# EAGLE design Master Controller Circuit (EAGLE 7.2.0)

## Sheet 1 of 5
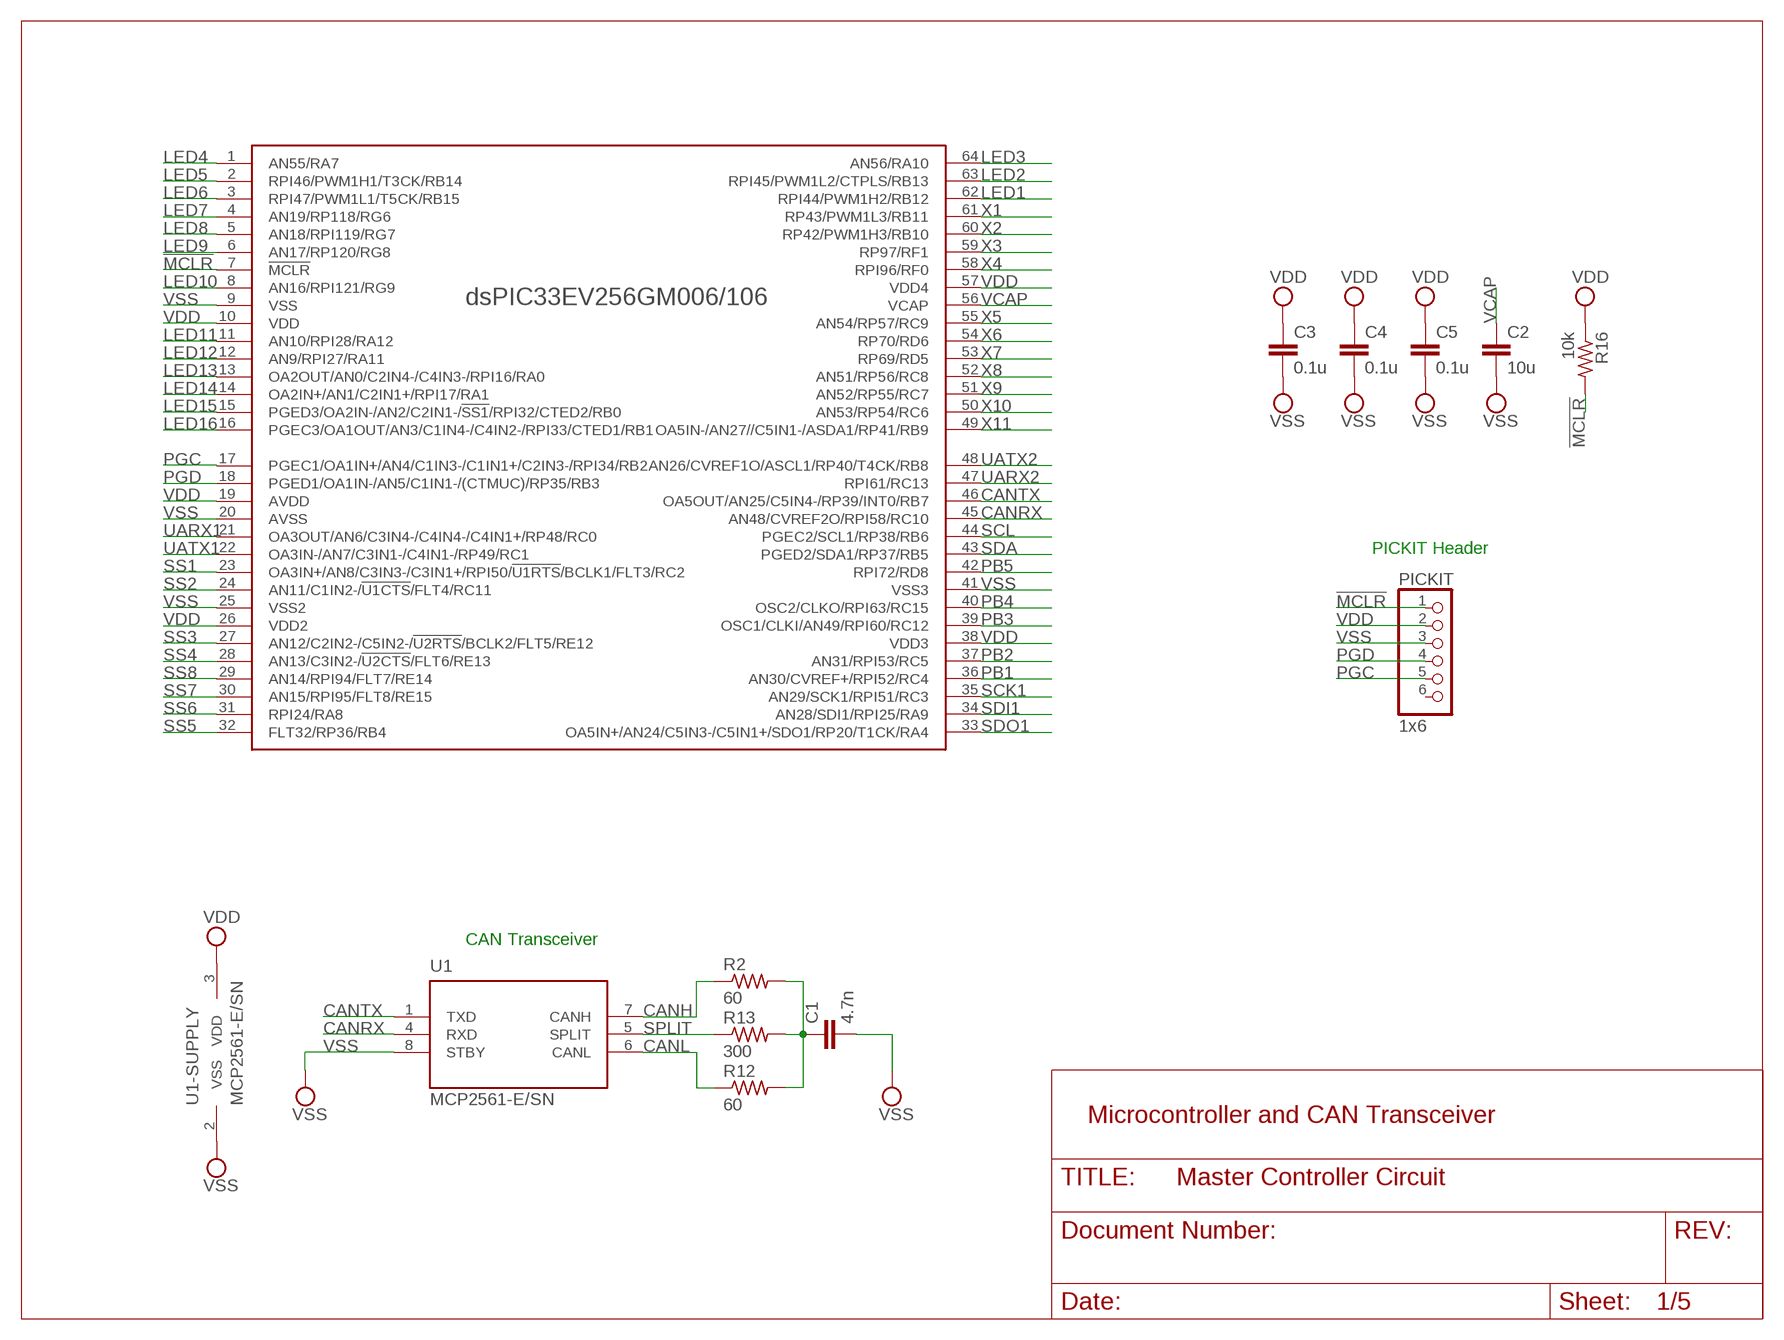
[diagram p0: schematic, sheet 1]

### Parts
C1  4.7n  C-EUC0805  [C0805]
C2  10u  C-EUC0805  [C0805]
C3  0.1u  C-EUC0805  [C0805]
C4  0.1u  C-EUC0805  [C0805]
C5  0.1u  C-EUC0805  [C0805]
PICKIT  1x6  PINHD-1X6  [1X06]
R2  60  R-US_R0805  [R0805]
R12  60  R-US_R0805  [R0805]
R13  300  R-US_R0805  [R0805]
R16  10k  R-US_R0805  [R0805]
U1  MCP2561-E/SN  [SOIC-8]
U$1  DSPIC33EV256GM106  [TQFP64-10X10]

### Nets
!MCLR: PICKIT.1 R16.2 U$1.7(!MCLR) ; also sheet 3
CANH: R2.1 U1.7(CANH) ; also sheet 5
CANL: R12.1 U1.6(CANL) ; also sheet 5
CANRX: U1.4(RXD) U$1.45(AN48/CVREF2O/RPI58/RC10)
CANTX: U1.1(TXD) U$1.46(OA5OUT/AN25/C5IN4-/RP39/INT0/RB7)
LED1: U$1.62(RPI44/PWM1H2/RB12) ; also sheet 3
LED2: U$1.63(RPI45/PWM1L2/CTPLS/RB13) ; also sheet 3
LED3: U$1.64(AN56/RA10) ; also sheet 3
LED4: U$1.1(AN55/RA7) ; also sheet 3
LED5: U$1.2(RPI46/PWM1H1/T3CK/RB14) ; also sheet 3
LED6: U$1.3(RPI47/PWM1L1/T5CK/RB15) ; also sheet 3
LED7: U$1.4(AN19/RP118/RG6) ; also sheet 3
LED8: U$1.5(AN18/RPI119/RG7) ; also sheet 3
LED9: U$1.6(AN17/RP120/RG8) ; also sheet 3
LED10: U$1.8(AN16/RPI121/RG9) ; also sheet 3
LED11: U$1.11(AN10/RPI28/RA12) ; also sheet 3
LED12: U$1.12(AN9/RPI27/RA11) ; also sheet 3
LED13: U$1.13(OA2OUT/AN0/C2IN4-/C4IN3-/RPI16/RA0) ; also sheet 3
LED14: U$1.14(OA2IN+/AN1/C2IN1+/RPI17/RA1) ; also sheet 3
LED15: U$1.15(PGED3/OA2IN-/AN2/C2IN1-/!SS1!/RPI32/CTED2/RB0) ; also sheet 3
LED16: U$1.16(PGEC3/OA1OUT/AN3/C1IN4-/C4IN2-/RPI33/CTED1/RB1) ; also sheet 3
N$3: C1.1 R2.2 R12.2 R13.2
PB1: U$1.36(AN30/CVREF+/RPI52/RC4) ; also sheet 3
PB2: U$1.37(AN31/RPI53/RC5) ; also sheet 3
PB3: U$1.39(OSC1/CLKI/AN49/RPI60/RC12) ; also sheet 3
PB4: U$1.40(OSC2/CLKO/RPI63/RC15) ; also sheet 3
PB5: U$1.42(RPI72/RD8) ; also sheet 3
PGC: PICKIT.5 U$1.17(PGEC1/OA1IN+/AN4/C1IN3-/C1IN1+/C2IN3-/RPI34/RB2)
PGD: PICKIT.4 U$1.18(PGED1/OA1IN-/AN5/C1IN1-/(CTMUC)/RP35/RB3)
SCK1: U$1.35(AN29/SCK1/RPI51/RC3) ; also sheet 5
SCL: U$1.44(PGEC2/SCL1/RP38/RB6) ; also sheet 2
SDA: U$1.43(PGED2/SDA1/RP37/RB5) ; also sheet 2
SDI1: U$1.34(AN28/SDI1/RPI25/RA9) ; also sheet 5
SDO1: U$1.33(OA5IN+/AN24/C5IN3-/C5IN1+/SDO1/RP20/T1CK/RA4) ; also sheet 5
SPLIT: R13.1 U1.5(SPLIT)
SS1: U$1.23(OA3IN+/AN8/C3IN3-/C3IN1+/RPI50/!U1RTS!/BCLK1/FLT3/RC2) ; also sheet 5
SS2: U$1.24(AN11/C1IN2-/!U1CTS!/FLT4/RC11) ; also sheet 5
SS3: U$1.27(AN12/C2IN2-/C5IN2-/!U2RTS!/BCLK2/FLT5/RE12) ; also sheet 5
SS4: U$1.28(AN13/C3IN2-/!U2CTS!/FLT6/RE13) ; also sheet 5
SS5: U$1.32(FLT32/RP36/RB4) ; also sheet 5
SS6: U$1.31(RPI24/RA8) ; also sheet 5
SS7: U$1.30(AN15/RPI95/FLT8/RE15) ; also sheet 5
SS8: U$1.29(AN14/RPI94/FLT7/RE14) ; also sheet 5
UARX1: U$1.21(OA3OUT/AN6/C3IN4-/C4IN4-/C4IN1+/RP48/RC0) ; also sheet 2
UARX2: U$1.47(RPI61/RC13) ; also sheet 2
UATX1: U$1.22(OA3IN-/AN7/C3IN1-/C4IN1-/RP49/RC1) ; also sheet 2
UATX2: U$1.48(AN26/CVREF1O/ASCL1/RP40/T4CK/RB8) ; also sheet 2
VCAP: C2.1 U$1.56(VCAP)
VDD: C3.1 C4.1 C5.1 PICKIT.2 R16.1 U1.3(VDD) U$1.10(VDD) U$1.19(AVDD) U$1.26(VDD2) U$1.38(VDD3) U$1.57(VDD4) ; also sheet 2,3,4,5
VSS: C1.2 C2.2 C3.2 C4.2 C5.2 PICKIT.3 U1.2(VSS) U1.8(STBY) U$1.9(VSS) U$1.20(AVSS) U$1.25(VSS2) U$1.41(VSS3) ; also sheet 2,3,4,5
X1: U$1.61(RP43/PWM1L3/RB11) ; also sheet 5
X2: U$1.60(RP42/PWM1H3/RB10) ; also sheet 5
X3: U$1.59(RP97/RF1) ; also sheet 5
X4: U$1.58(RPI96/RF0) ; also sheet 5
X5: U$1.55(AN54/RP57/RC9) ; also sheet 5
X6: U$1.54(RP70/RD6) ; also sheet 5
X7: U$1.53(RP69/RD5) ; also sheet 5
X8: U$1.52(AN51/RP56/RC8) ; also sheet 5
X9: U$1.51(AN52/RP55/RC7) ; also sheet 5
X10: U$1.50(AN53/RP54/RC6) ; also sheet 5
X11: U$1.49(OA5IN-/AN27//C5IN1-/ASDA1/RP41/RB9) ; also sheet 5
Unconnected: PICKIT.6

### Notes on the sheet
- PICKIT Header
- CAN Transceiver
- Microcontroller and CAN Transceiver

## Sheet 2 of 5
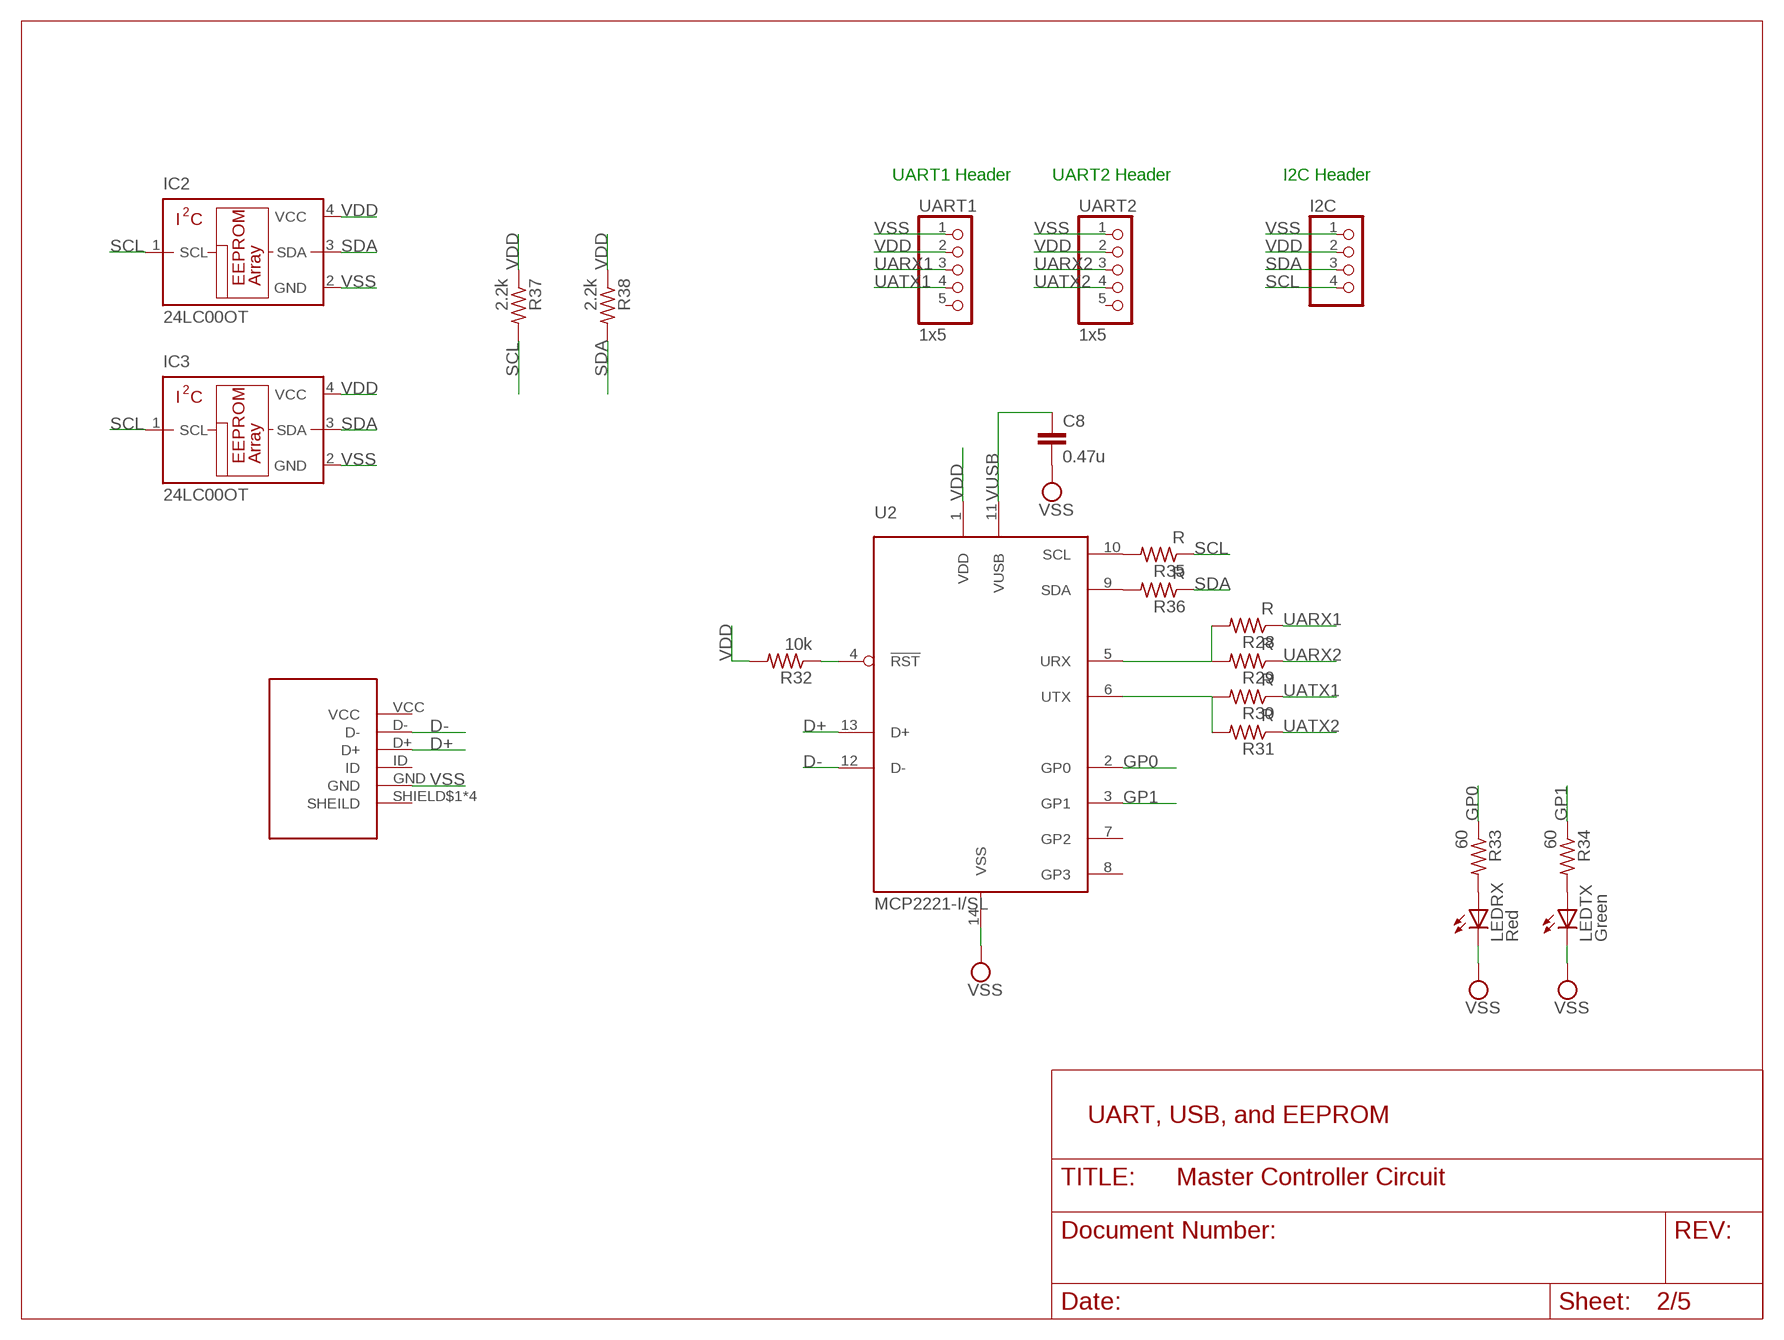
[diagram p1: schematic, sheet 2]

### Parts
C8  0.47u  C-EUC0805  [C0805]
I2C  PINHD-1X4  [1X04]
IC2  24LC00OT  [SOT23-5L]
IC3  24LC00OT  [SOT23-5L]
J1  10118193-0001LF  [10118193-0001LF]
LEDRX  Red  LEDCHIP-LED0805  [CHIP-LED0805]
LEDTX  Green  LEDCHIP-LED0805  [CHIP-LED0805]
R28  R  R-US_R0805  [R0805]
R29  R  R-US_R0805  [R0805]
R30  R  R-US_R0805  [R0805]
R31  R  R-US_R0805  [R0805]
R32  10k  R-US_R0805  [R0805]
R33  60  R-US_R0805  [R0805]
R34  60  R-US_R0805  [R0805]
R35  R  R-US_R0805  [R0805]
R36  R  R-US_R0805  [R0805]
R37  2.2k  R-US_R0805  [R0805]
R38  2.2k  R-US_R0805  [R0805]
U2  MCP2221-I/SL  [SOIC14]
UART1  1x5  PINHD-1X5  [1X05]
UART2  1x5  PINHD-1X5  [1X05]

### Nets
D+: J1.D+ U2.13(D+)
D-: J1.D- U2.12(D-)
GP0: R33.1 U2.2(GP0)
GP1: R34.1 U2.3(GP1)
N$15: R28.2 R29.2 U2.5(URX)
N$16: R30.2 R31.2 U2.6(UTX)
N$19: R35.2 U2.10(SCL)
N$20: R36.2 U2.9(SDA)
N$30: R32.1 U2.4(!RST)
N$31: LEDRX.A R33.2
N$32: LEDTX.A R34.2
SCL: I2C.4 IC2.1(SCL) IC3.1(SCL) R35.1 R37.2 ; also sheet 1
SDA: I2C.3 IC2.3(SDA) IC3.3(SDA) R36.1 R38.2 ; also sheet 1
UARX1: R28.1 UART1.3 ; also sheet 1
UARX2: R29.1 UART2.3 ; also sheet 1
UATX1: R30.1 UART1.4 ; also sheet 1
UATX2: R31.1 UART2.4 ; also sheet 1
VDD: I2C.2 IC2.4(VCC) IC3.4(VCC) R32.2 R37.1 R38.1 U2.1(VDD) UART1.2 UART2.2 ; also sheet 1,3,4,5
VSS: C8.2 I2C.1 IC2.2(GND) IC3.2(GND) J1.GND LEDRX.C LEDTX.C U2.14(VSS) UART1.1 UART2.1 ; also sheet 1,3,4,5
VUSB: C8.1 U2.11(VUSB)
Unconnected: J1.ID J1.SHIELD$1(SHEILD) J1.SHIELD$2(SHEILD) J1.SHIELD$3(SHEILD) J1.SHIELD$4(SHEILD) J1.VCC U2.7(GP2) U2.8(GP3) UART1.5 UART2.5

### Notes on the sheet
- UART1 Header | UART2 Header | I2C Header
- UART, USB, and EEPROM

## Sheet 3 of 5
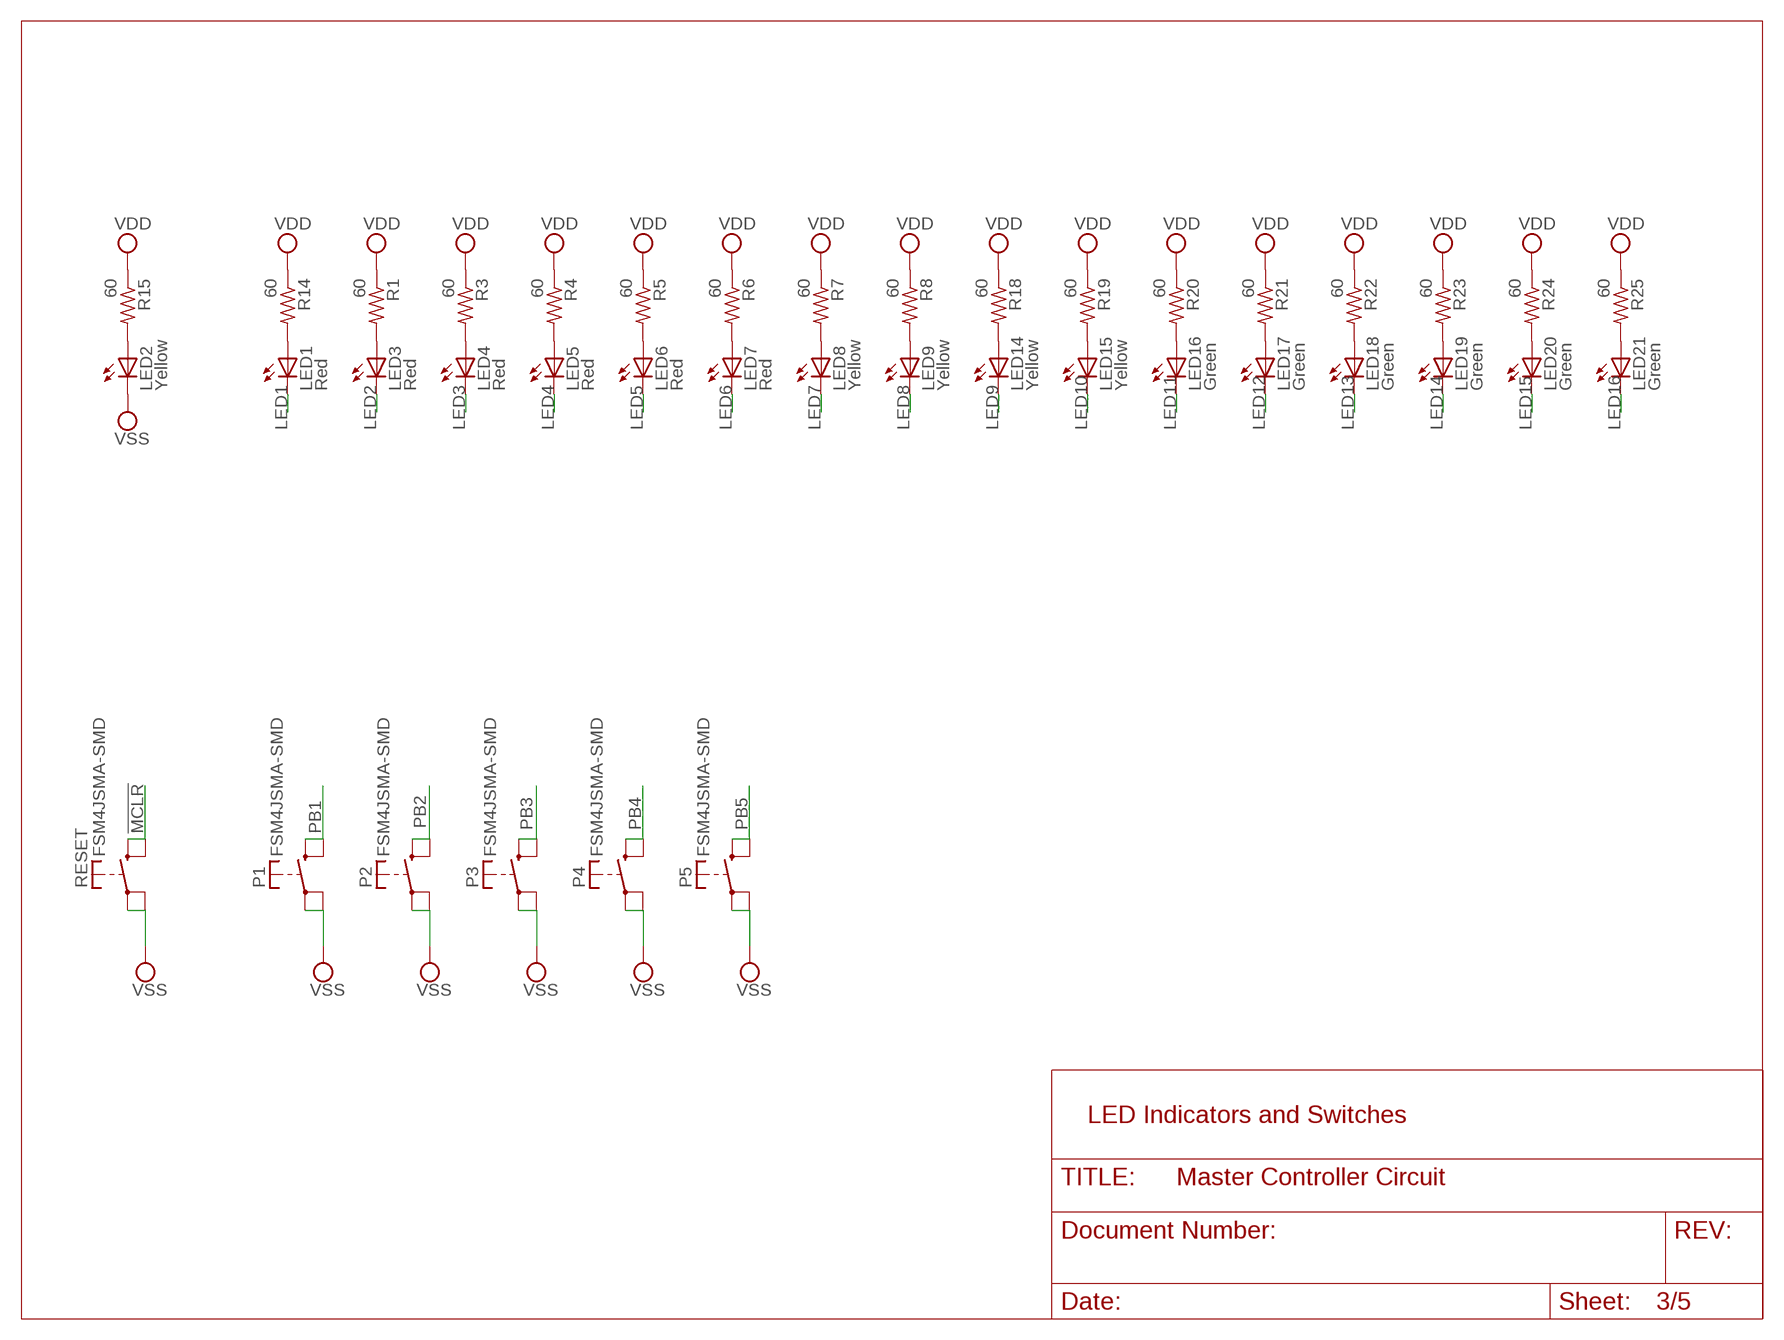
[diagram p2: schematic, sheet 3]

### Parts
LED1  Red  LEDCHIP-LED0805  [CHIP-LED0805]
LED2  Yellow  LEDCHIP-LED0805  [CHIP-LED0805]
LED3  Red  LEDCHIP-LED0805  [CHIP-LED0805]
LED4  Red  LEDCHIP-LED0805  [CHIP-LED0805]
LED5  Red  LEDCHIP-LED0805  [CHIP-LED0805]
LED6  Red  LEDCHIP-LED0805  [CHIP-LED0805]
LED7  Red  LEDCHIP-LED0805  [CHIP-LED0805]
LED8  Yellow  LEDCHIP-LED0805  [CHIP-LED0805]
LED9  Yellow  LEDCHIP-LED0805  [CHIP-LED0805]
LED14  Yellow  LEDCHIP-LED0805  [CHIP-LED0805]
LED15  Yellow  LEDCHIP-LED0805  [CHIP-LED0805]
LED16  Green  LEDCHIP-LED0805  [CHIP-LED0805]
LED17  Green  LEDCHIP-LED0805  [CHIP-LED0805]
LED18  Green  LEDCHIP-LED0805  [CHIP-LED0805]
LED19  Green  LEDCHIP-LED0805  [CHIP-LED0805]
LED20  Green  LEDCHIP-LED0805  [CHIP-LED0805]
LED21  Green  LEDCHIP-LED0805  [CHIP-LED0805]
P1  FSM4JSMA-SMD  [FSM4JSMA-SMD]
P2  FSM4JSMA-SMD  [FSM4JSMA-SMD]
P3  FSM4JSMA-SMD  [FSM4JSMA-SMD]
P4  FSM4JSMA-SMD  [FSM4JSMA-SMD]
P5  FSM4JSMA-SMD  [FSM4JSMA-SMD]
R1  60  R-US_R0805  [R0805]
R3  60  R-US_R0805  [R0805]
R4  60  R-US_R0805  [R0805]
R5  60  R-US_R0805  [R0805]
R6  60  R-US_R0805  [R0805]
R7  60  R-US_R0805  [R0805]
R8  60  R-US_R0805  [R0805]
R14  60  R-US_R0805  [R0805]
R15  60  R-US_R0805  [R0805]
R18  60  R-US_R0805  [R0805]
R19  60  R-US_R0805  [R0805]
R20  60  R-US_R0805  [R0805]
R21  60  R-US_R0805  [R0805]
R22  60  R-US_R0805  [R0805]
R23  60  R-US_R0805  [R0805]
R24  60  R-US_R0805  [R0805]
R25  60  R-US_R0805  [R0805]
RESET  FSM4JSMA-SMD  [FSM4JSMA-SMD]

### Nets
!MCLR: RESET.P$3(S) RESET.P$4(S) ; also sheet 1
LED1: LED1.C ; also sheet 1
LED2: LED3.C ; also sheet 1
LED3: LED4.C ; also sheet 1
LED4: LED5.C ; also sheet 1
LED5: LED6.C ; also sheet 1
LED6: LED7.C ; also sheet 1
LED7: LED8.C ; also sheet 1
LED8: LED9.C ; also sheet 1
LED9: LED14.C ; also sheet 1
LED10: LED15.C ; also sheet 1
LED11: LED16.C ; also sheet 1
LED12: LED17.C ; also sheet 1
LED13: LED18.C ; also sheet 1
LED14: LED19.C ; also sheet 1
LED15: LED20.C ; also sheet 1
LED16: LED21.C ; also sheet 1
N$4: LED1.A R14.2
N$6: LED2.A R15.2
N$68: LED3.A R1.2
N$69: LED4.A R3.2
N$70: LED5.A R4.2
N$71: LED6.A R5.2
N$72: LED7.A R6.2
N$73: LED8.A R7.2
N$74: LED9.A R8.2
N$79: LED14.A R18.2
N$80: LED15.A R19.2
N$81: LED16.A R20.2
N$82: LED17.A R21.2
N$83: LED18.A R22.2
N$84: LED19.A R23.2
N$85: LED20.A R24.2
N$86: LED21.A R25.2
PB1: P1.P$3(S) P1.P$4(S) ; also sheet 1
PB2: P2.P$3(S) P2.P$4(S) ; also sheet 1
PB3: P3.P$3(S) P3.P$4(S) ; also sheet 1
PB4: P4.P$3(S) P4.P$4(S) ; also sheet 1
PB5: P5.P$3(S) P5.P$4(S) ; also sheet 1
VDD: R1.1 R3.1 R4.1 R5.1 R6.1 R7.1 R8.1 R14.1 R15.1 R18.1 R19.1 R20.1 R21.1 R22.1 R23.1 R24.1 R25.1 ; also sheet 1,2,4,5
VSS: LED2.C P1.P$1(P) P1.P$2(P) P2.P$1(P) P2.P$2(P) P3.P$1(P) P3.P$2(P) P4.P$1(P) P4.P$2(P) P5.P$1(P) P5.P$2(P) RESET.P$1(P) RESET.P$2(P) ; also sheet 1,2,4,5

### Notes on the sheet
- LED Indicators and Switches

## Sheet 4 of 5
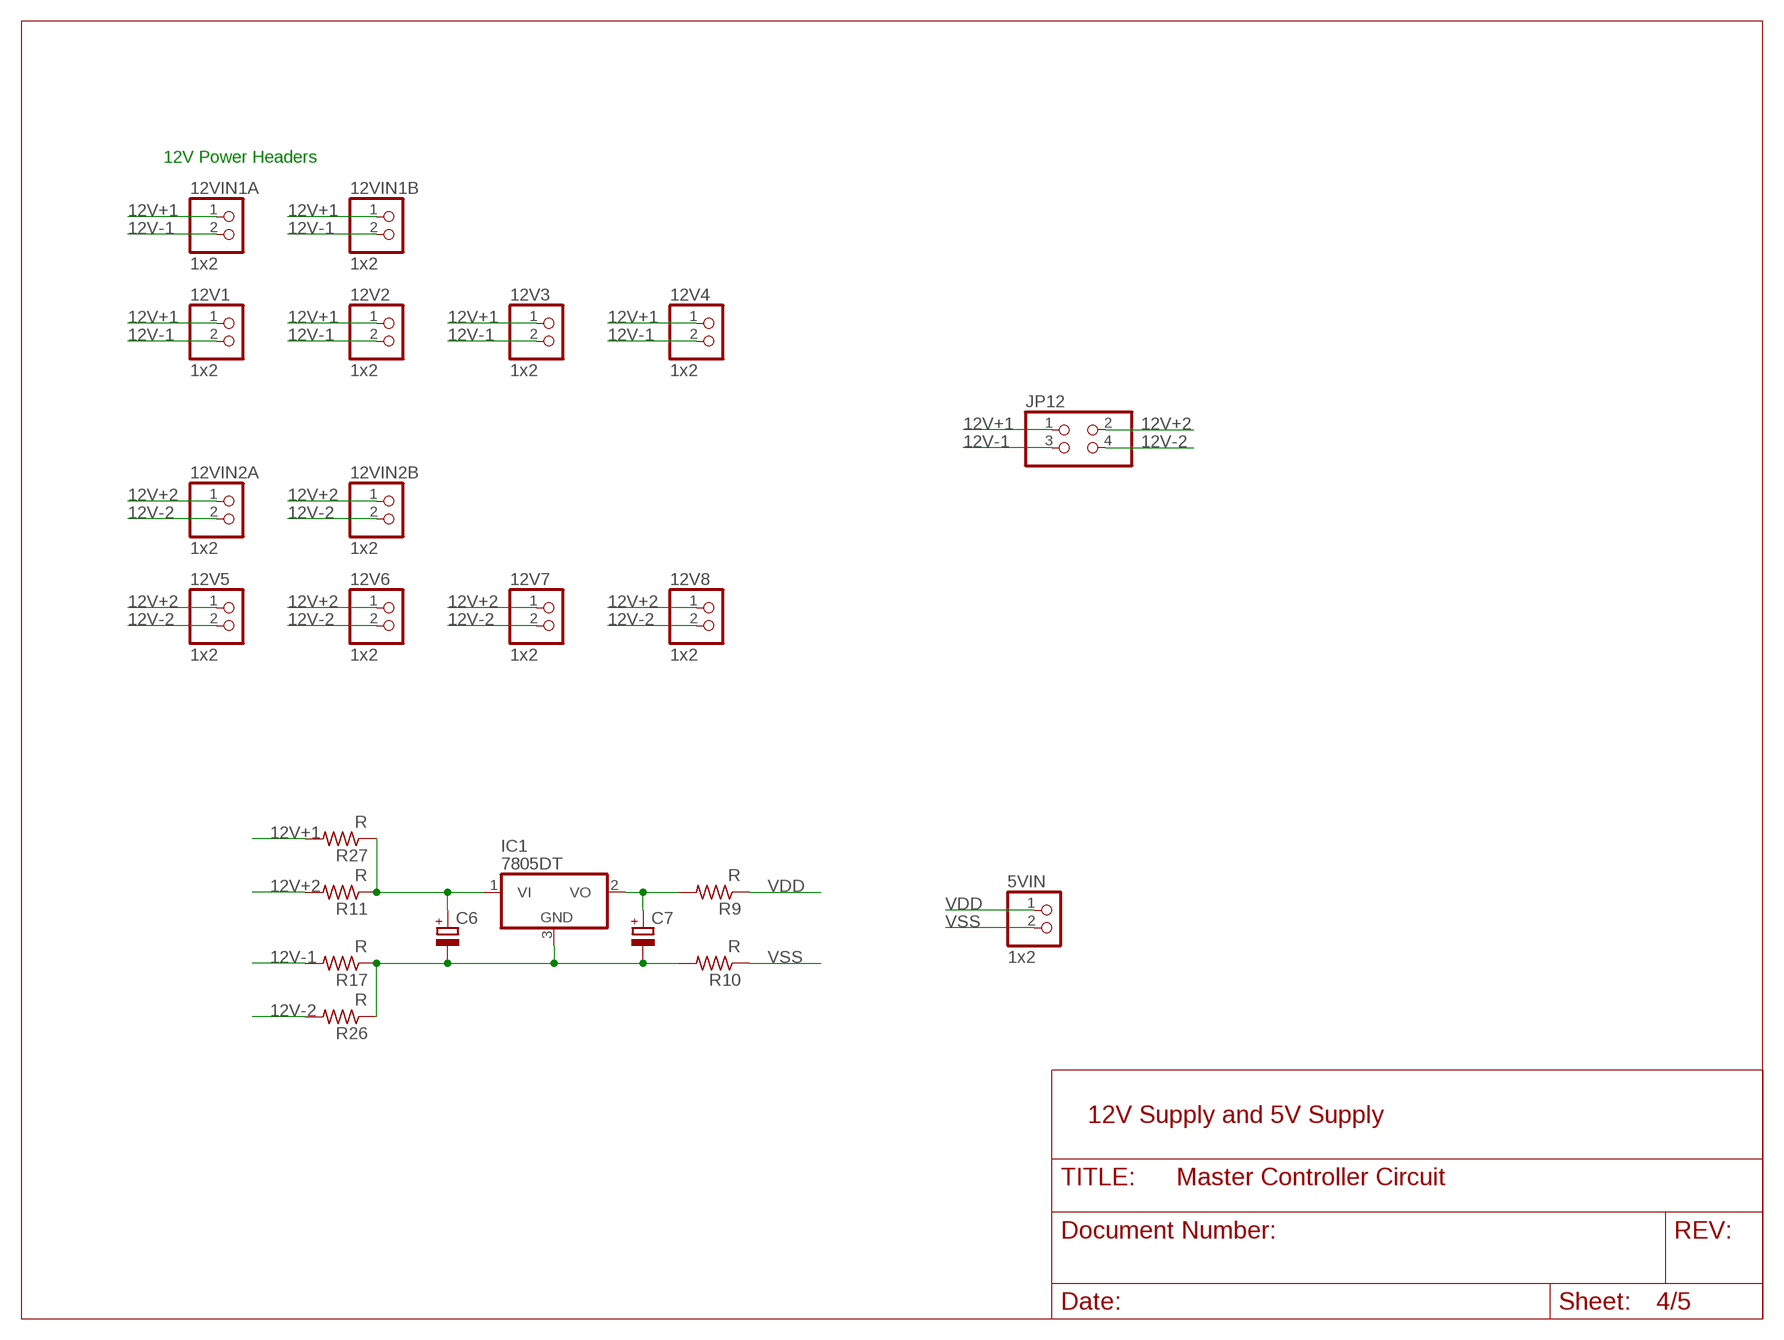
[diagram p3: schematic, sheet 4]

### Parts
5VIN  1x2  PINHD-1X2  [1X02]
12V1  1x2  PINHD-1X2  [1X02]
12V2  1x2  PINHD-1X2  [1X02]
12V3  1x2  PINHD-1X2  [1X02]
12V4  1x2  PINHD-1X2  [1X02]
12V5  1x2  PINHD-1X2  [1X02]
12V6  1x2  PINHD-1X2  [1X02]
12V7  1x2  PINHD-1X2  [1X02]
12V8  1x2  PINHD-1X2  [1X02]
12VIN1A  1x2  PINHD-1X2  [1X02]
12VIN1B  1x2  PINHD-1X2  [1X02]
12VIN2A  1x2  PINHD-1X2  [1X02]
12VIN2B  1x2  PINHD-1X2  [1X02]
C6  CPOL-EU153CLV-0605  [153CLV-0605]
C7  CPOL-EU153CLV-0605  [153CLV-0605]
IC1  7805DT  [TO252]
JP12  PINHD-2X2  [2X02]
R9  R  R-US_R0805  [R0805]
R10  R  R-US_R0805  [R0805]
R11  R  R-US_R0805  [R0805]
R17  R  R-US_R0805  [R0805]
R26  R  R-US_R0805  [R0805]
R27  R  R-US_R0805  [R0805]

### Nets
12V+1: 12V1.1 12V2.1 12V3.1 12V4.1 12VIN1A.1 12VIN1B.1 JP12.1 R27.2
12V+2: 12V5.1 12V6.1 12V7.1 12V8.1 12VIN2A.1 12VIN2B.1 JP12.2 R11.2
12V-1: 12V1.2 12V2.2 12V3.2 12V4.2 12VIN1A.2 12VIN1B.2 JP12.3 R17.2
12V-2: 12V5.2 12V6.2 12V7.2 12V8.2 12VIN2A.2 12VIN2B.2 JP12.4 R26.2
N$17: C7.+ IC1.2(VO) R9.2
N$18: C6.- C7.- IC1.3(GND) R10.2 R17.1 R26.1
N$21: C6.+ IC1.1(VI) R11.1 R27.1
VDD: 5VIN.1 R9.1 ; also sheet 1,2,3,5
VSS: 5VIN.2 R10.1 ; also sheet 1,2,3,5

### Notes on the sheet
- 12V Power Headers
- 12V Supply and 5V Supply

## Sheet 5 of 5
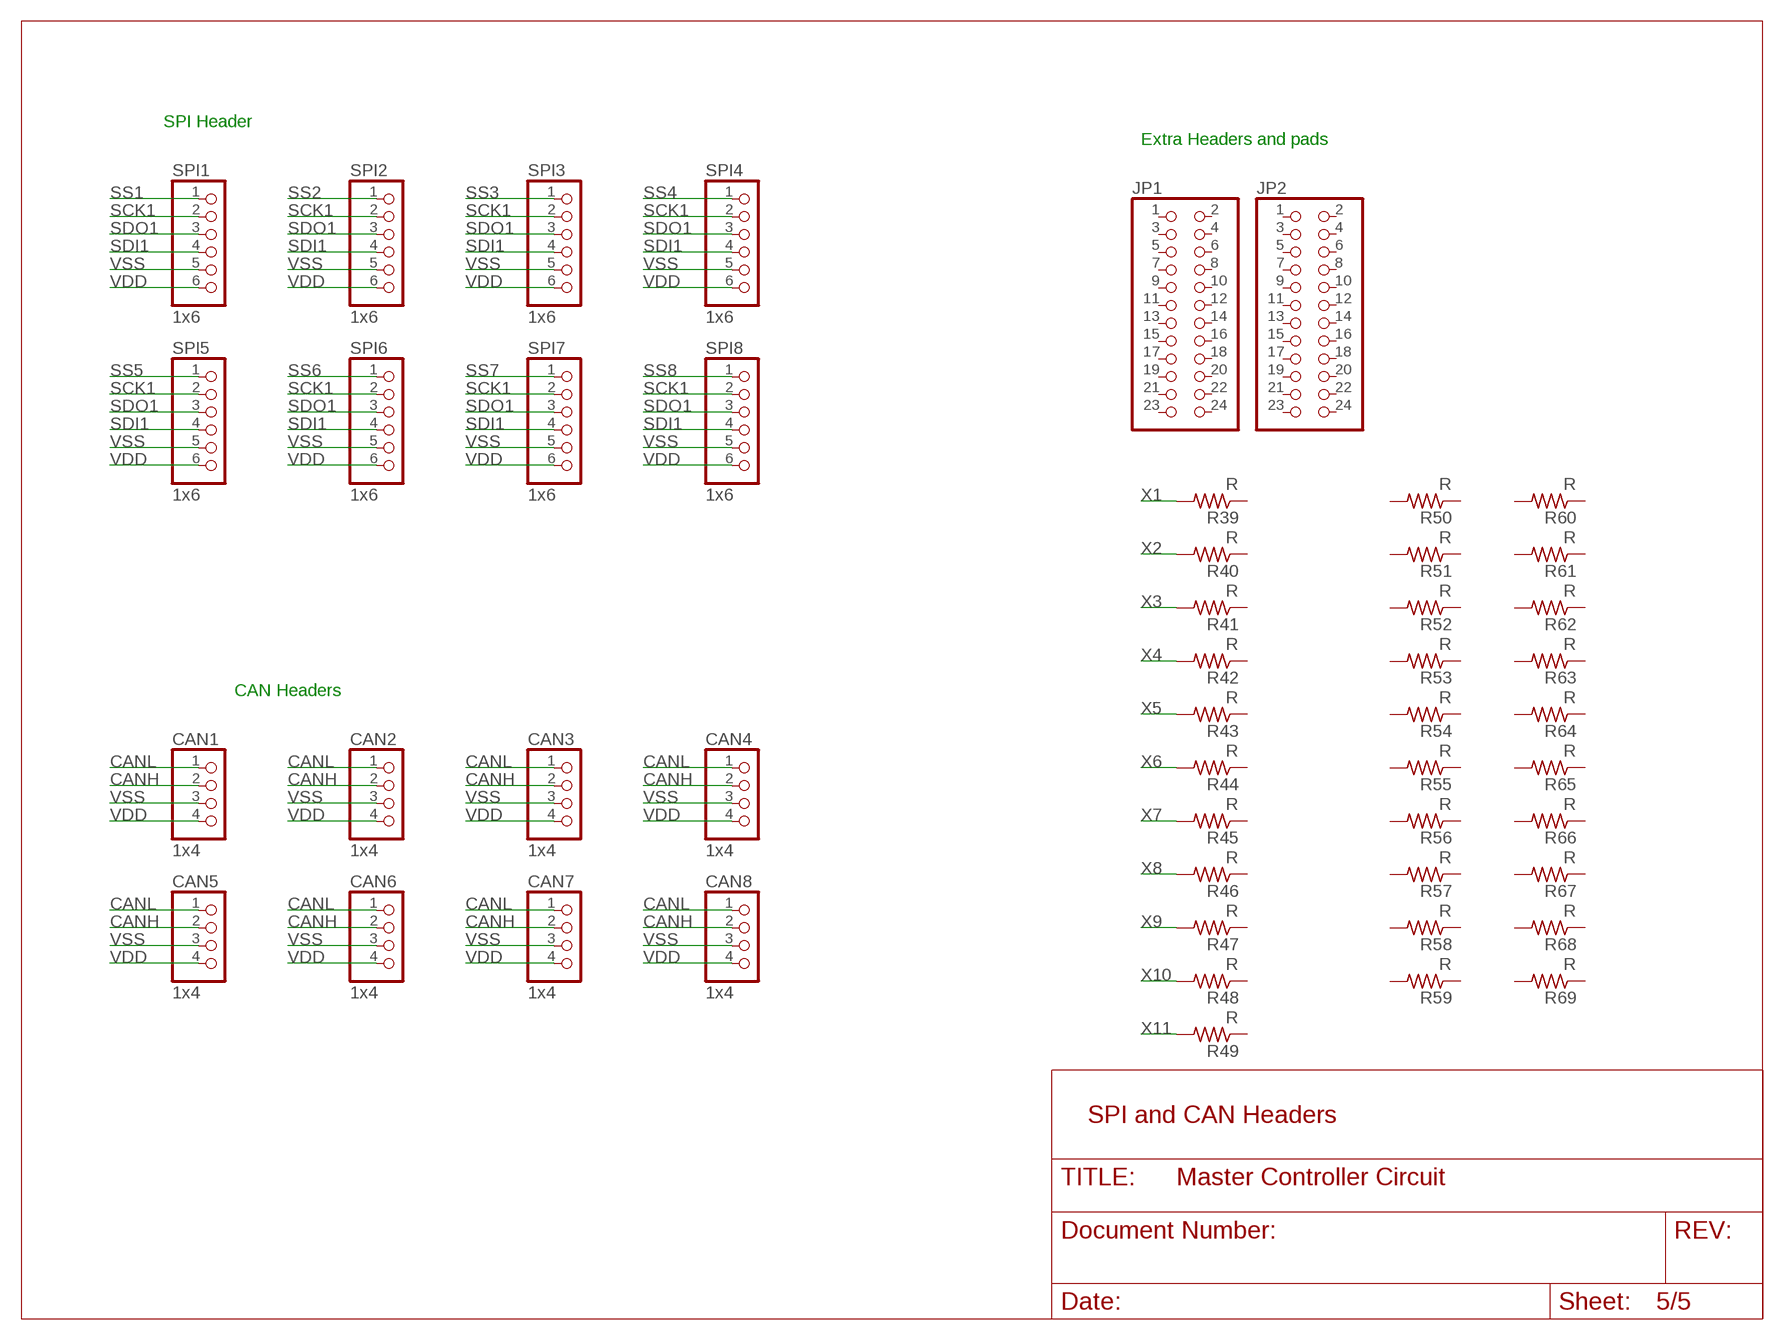
[diagram p4: schematic, sheet 5]

### Parts
CAN1  1x4  PINHD-1X4  [1X04]
CAN2  1x4  PINHD-1X4  [1X04]
CAN3  1x4  PINHD-1X4  [1X04]
CAN4  1x4  PINHD-1X4  [1X04]
CAN5  1x4  PINHD-1X4  [1X04]
CAN6  1x4  PINHD-1X4  [1X04]
CAN7  1x4  PINHD-1X4  [1X04]
CAN8  1x4  PINHD-1X4  [1X04]
JP1  PINHD-2X12  [2X12]
JP2  PINHD-2X12  [2X12]
R39  R  R-US_R0603  [R0603]
R40  R  R-US_R0603  [R0603]
R41  R  R-US_R0603  [R0603]
R42  R  R-US_R0603  [R0603]
R43  R  R-US_R0603  [R0603]
R44  R  R-US_R0603  [R0603]
R45  R  R-US_R0603  [R0603]
R46  R  R-US_R0603  [R0603]
R47  R  R-US_R0603  [R0603]
R48  R  R-US_R0603  [R0603]
R49  R  R-US_R0603  [R0603]
R50  R  R-US_R0603  [R0603]
R51  R  R-US_R0603  [R0603]
R52  R  R-US_R0603  [R0603]
R53  R  R-US_R0603  [R0603]
R54  R  R-US_R0603  [R0603]
R55  R  R-US_R0603  [R0603]
R56  R  R-US_R0603  [R0603]
R57  R  R-US_R0603  [R0603]
R58  R  R-US_R0603  [R0603]
R59  R  R-US_R0603  [R0603]
R60  R  R-US_R0603  [R0603]
R61  R  R-US_R0603  [R0603]
R62  R  R-US_R0603  [R0603]
R63  R  R-US_R0603  [R0603]
R64  R  R-US_R0603  [R0603]
R65  R  R-US_R0603  [R0603]
R66  R  R-US_R0603  [R0603]
R67  R  R-US_R0603  [R0603]
R68  R  R-US_R0603  [R0603]
R69  R  R-US_R0603  [R0603]
SPI1  1x6  PINHD-1X6  [1X06]
SPI2  1x6  PINHD-1X6  [1X06]
SPI3  1x6  PINHD-1X6  [1X06]
SPI4  1x6  PINHD-1X6  [1X06]
SPI5  1x6  PINHD-1X6  [1X06]
SPI6  1x6  PINHD-1X6  [1X06]
SPI7  1x6  PINHD-1X6  [1X06]
SPI8  1x6  PINHD-1X6  [1X06]

### Nets
CANH: CAN1.2 CAN2.2 CAN3.2 CAN4.2 CAN5.2 CAN6.2 CAN7.2 CAN8.2 ; also sheet 1
CANL: CAN1.1 CAN2.1 CAN3.1 CAN4.1 CAN5.1 CAN6.1 CAN7.1 CAN8.1 ; also sheet 1
SCK1: SPI1.2 SPI2.2 SPI3.2 SPI4.2 SPI5.2 SPI6.2 SPI7.2 SPI8.2 ; also sheet 1
SDI1: SPI1.4 SPI2.4 SPI3.4 SPI4.4 SPI5.4 SPI6.4 SPI7.4 SPI8.4 ; also sheet 1
SDO1: SPI1.3 SPI2.3 SPI3.3 SPI4.3 SPI5.3 SPI6.3 SPI7.3 SPI8.3 ; also sheet 1
SS1: SPI1.1 ; also sheet 1
SS2: SPI2.1 ; also sheet 1
SS3: SPI3.1 ; also sheet 1
SS4: SPI4.1 ; also sheet 1
SS5: SPI5.1 ; also sheet 1
SS6: SPI6.1 ; also sheet 1
SS7: SPI7.1 ; also sheet 1
SS8: SPI8.1 ; also sheet 1
VDD: CAN1.4 CAN2.4 CAN3.4 CAN4.4 CAN5.4 CAN6.4 CAN7.4 CAN8.4 SPI1.6 SPI2.6 SPI3.6 SPI4.6 SPI5.6 SPI6.6 SPI7.6 SPI8.6 ; also sheet 1,2,3,4
VSS: CAN1.3 CAN2.3 CAN3.3 CAN4.3 CAN5.3 CAN6.3 CAN7.3 CAN8.3 SPI1.5 SPI2.5 SPI3.5 SPI4.5 SPI5.5 SPI6.5 SPI7.5 SPI8.5 ; also sheet 1,2,3,4
X1: R39.2 ; also sheet 1
X2: R40.2 ; also sheet 1
X3: R41.2 ; also sheet 1
X4: R42.2 ; also sheet 1
X5: R43.2 ; also sheet 1
X6: R44.2 ; also sheet 1
X7: R45.2 ; also sheet 1
X8: R46.2 ; also sheet 1
X9: R47.2 ; also sheet 1
X10: R48.2 ; also sheet 1
X11: R49.2 ; also sheet 1
Unconnected: JP1.1 JP1.2 JP1.3 JP1.4 JP1.5 JP1.6 JP1.7 JP1.8 JP1.9 JP1.10 JP1.11 JP1.12 JP1.13 JP1.14 JP1.15 JP1.16 JP1.17 JP1.18 JP1.19 JP1.20 JP1.21 JP1.22 JP1.23 JP1.24 JP2.1 JP2.2 JP2.3 JP2.4 JP2.5 JP2.6 JP2.7 JP2.8 JP2.9 JP2.10 JP2.11 JP2.12 JP2.13 JP2.14 JP2.15 JP2.16 JP2.17 JP2.18 JP2.19 JP2.20 JP2.21 JP2.22 JP2.23 JP2.24 R39.1 R40.1 R41.1 R42.1 R43.1 R44.1 R45.1 R46.1 R47.1 R48.1 R49.1 R50.1 R50.2 R51.1 R51.2 R52.1 R52.2 R53.1 R53.2 R54.1 R54.2 R55.1 R55.2 R56.1 R56.2 R57.1 R57.2 R58.1 R58.2 R59.1 R59.2 R60.1 R60.2 R61.1 R61.2 R62.1 R62.2 R63.1 R63.2 R64.1 R64.2 R65.1 R65.2 R66.1 R66.2 R67.1 R67.2 R68.1 R68.2 R69.1 R69.2

### Notes on the sheet
- SPI Header
- Extra Headers and pads
- CAN Headers
- SPI and CAN Headers

## Library data of the parts
5VIN 12V1-12V8 12VIN1A 12VIN1B 12VIN2A 12VIN2B = pinhead:PINHD-1X2: PIN HEADER
C1-C5 C8 = rcl:C-EU: CAPACITOR, European symbol
C6 C7 = rcl:CPOL-EU: POLARIZED CAPACITOR, European symbol
CAN1-CAN8 I2C = pinhead:PINHD-1X4: PIN HEADER
IC1 = linear:78*: Positive VOLTAGE REGULATOR Source: http://cache.national.com/ds/LM/LM78L05.pdf http://www.fairchildsemi.com/ds/LM/LM7805.pdf
IC2 IC3 = microchip:24*00: Serial EEPROM 128 bit, I2C (AA = 1.8 V/LC = 2.5 V/C = 5.0 V); MF: MICROCHIP; MPN: 24LC00T-I/OT; OC_FARNELL: 9757864; OC_NEWARK: 62K0574
J1 = 10118193-0001LF:10118193-0001LF
JP1 JP2 = pinhead:PINHD-2X12: PIN HEADER
JP12 = pinhead:PINHD-2X2: PIN HEADER
LED1-LED9 LED14-LED21 LEDRX LEDTX = led:LED: LED OSRAM: - CHIPLED LG R971, LG N971, LY N971, LG Q971, LY Q971, LO R971, LY R971 LH N974, LH R974 LS Q976, LO Q976, LY Q976 LO Q996 - Hyper CHIPLED LW Q18S LB Q993, LB Q99A, LB R99A - SideLED LS A670, LO A670, LY A670, LG A670, LP A670 LB A673, LV A673, LT A673, LW A673 LH A674 LY A675 LS A676, LA A676, LO A676, LY A676, LW A676 LS A679, LY A679, LG A679 - Hyper Micro SIDELED® LS Y876, LA Y876, LO Y876, LY Y876 LT Y87S - SmartLED LW L88C, LW L88S LB L89C, LB L89S, LG L890 LS L89K, LO L89K, LY L89K LS L896, LA L896, LO L896, LY L896 - TOPLED LS T670, LO T670, LY T670, LG T670, LP T670 LSG T670, LSP T670, LSY T670, LOP T670, LYG T670 LG T671, LOG T671, LSG T671 LB T673, LV T673, LT T673, LW T673 LH T674 LS T676, LA T676, LO T676, LY T676, LB T676, LH T676, LSB T676, LW T676 LB T67C, LV T67C, LT T67C, LS T67K, LO T67K, LY T67K, LW E67C LS E67B, LA E67B, LO E67B, LY E67B, LB E67C, LV E67C, LT E67C LW T67C LS T679, LY T679, LG T679 LS T770, LO T770, LY T770, LG T770, LP T770 LB T773, LV T773, LT T773, LW T773 LH T774 LS E675, LA E675, LY E675, LS T675 LS T776, LA T776, LO T776, LY T776, LB T776 LHGB T686 LT T68C, LB T68C - Hyper Mini TOPLED® LB M676 - Mini TOPLED Santana® LG M470 LS M47K, LO M47K, LY M47K Source: http://www.osram.convergy.de LUXEON: - LUMILED® LXK2-PW12-R00, LXK2-PW12-S00, LXK2-PW14-U00, LXK2-PW14-V00 LXK2-PM12-R00, LXK2-PM12-S00, LXK2-PM14-U00 LXK2-PE12-Q00, LXK2-PE12-R00, LXK2-PE12-S00, LXK2-PE14-T00, LXK2-PE14-U00 LXK2-PB12-K00, LXK2-PB12-L00, LXK2-PB12-M00, LXK2-PB14-N00, LXK2-PB14-P00, LXK2-PB14-Q00 LXK2-PR12-L00, LXK2-PR12-M00, LXK2-PR14-Q00, LXK2-PR14-R00 LXK2-PD12-Q00, LXK2-PD12-R00, LXK2-PD12-S00 LXK2-PH12-R00, LXK2-PH12-S00 LXK2-PL12-P00, LXK2-PL12-Q00, LXK2-PL12-R00 Source: www.luxeon.com KINGBRIGHT: KA-3528ASYC Source: www.kingbright.com
P1-P5 RESET = switch-misc:FSM4JSMA-SMD: TYCO SWITCH
PICKIT SPI1-SPI8 = pinhead:PINHD-1X6: PIN HEADER
R1-R69 = rcl:R-US_: RESISTOR, American symbol
U1 = Volks73-MicrochipTechnology:MCP2561-*/?: High-Speed CAN Transceiver Documentation Datasheet <http://ww1.microchip.com/downloads/en/DeviceDoc/20005167C.pdf> General Description The MCP2561/2 is a Microchip Technology Inc. second generation high-speed CAN transceiver. It serves as an interface between a CAN protocol controller and the physical two-wire CAN bus. The device meets the automotive requirements for high-speed (up to 1 Mb/s), low quiescent current, electromagnetic compatibility (EMC) and electrostatis discharge (ESD). Features Supports 1 Mb/s Operation Implements ISO-11898-2 and ISO-11898-5 Standard Physical Layer Requirements Very Low Standby Current (5 µA, typical) VIO Supply Pin to Interface Directly to CAN Controllers and Microcontrollers with 1.8V to 5.5V I/O SPLIT Output Pin to Stabilize Common Mode in Biased Split Termination Schemes CAN Bus Pins are Disconnected when Device is Unpowered: An Unpowered Node or Brown-Out Event will Not Load the CAN Bus Detection of Ground Fault: Permanent Dominant Detection on TXD Permanent Dominant Detection on Bus Power-on Reset and Voltage Brown-Out Protection on VDD Pin Protection Against Damage Due to Short-Circuit Conditions (Positive or Negative Battery Voltage) Protection Against High-Voltage Transients in Automotive Environments Automatic Thermal Shutdown Protection Suitable for 12V and 24V Systems Meets or exceeds stringent automotive design requirements including “Hardware Requirements for LIN, CAN and FlexRay Interfaces in Automotive Applications”, Version 1.3, May 2012 High-Noise Immunity Due to Differential Bus Implementation High Electrostatic Discharge (ESD) Protection on CANH and CANL, meeting the IEC61000-4-2 up to ±14 kV Available in PDIP-8L, SOIC-8L and 3x3 DFN-8L Temperature ranges: Extended (E): -40°C to +125°C High (H): -40°C to +150°C; CATEGORY: Integrated Circuits (ICs); DATA_RATE: -; DESCRIPTION: IC TXRX CAN 8SOIC; DOCUMENTATION_LINK: <a href="http://ww1.microchip.com/downloads/en/DeviceDoc/20005167C.pdf">Datasheet</a>; DOCUMENTATION_URL: http://ww1.microchip.com/downloads/en/DeviceDoc/20005167C.pdf; DUPLEX: Full; FAMILY: Interface - Drivers, Receivers, Transceivers; MANUFACTURER: Microchip Technology; MOUNTING_TYPE: Surface Mount; NUMBER_OF_DRIVERS-RECEIVERS: 1/1; OPERATING_TEMPERATURE: -40°C ~ 125°C; PACKAGE_CASE: 8-SOIC (0.154", 3.90mm Width); PART_NUMBER: MCP2561-E/SN; PROTOCOL: CAN; RECEIVER_HYSTERSIS: -; SERIES: -; SUPPLIER_DEVICE_PACKAGE: 8-SOIC N; SUPPLIER_ITEM_INFO: http://www.digikey.com/product-detail/en/MCP2561-E%2FSN/MCP2561-E%2FSN-ND/4079961; SUPPLIER_ITEM_LINK: <a href="http://www.digikey.com/product-detail/en/MCP2561-E%2FSN/MCP2561-E%2FSN-ND/4079961">Details</a>; SUPPLIER_ITEM_NUMBER: MCP2561-E/SN-ND; SUPPLIER_ITEM_URL: http://www.digikey.com/product-detail/en/MCP2561-E%2FSN/MCP2561-E%2FSN-ND/4079961; SUPPLIER_LINK: <a href="http://www.digikey.com">Home Page</a>; SUPPLIER_NAME: Digi-Key; SUPPLIER_URL: http://www.digikey.com; TYPE: Transceiver; VOLTAGE-SUPPLY: 4.5 V ~ 5.5 V
U2 = microchip-mcp2221:MCP2221-*: MCP2221 in PDIP, SOIC and TSSOP package The MCP2221 is a USB-to-UART/I2C serial converter which enables USB connectivity in applications that have a UART and I2C interfaces. The device reduces external components by integrating the USB termination resistors and the oscillator needed for USB operation. The MCP2221 also has four GP pins providing miscellaneous functionalities (GPIO, USBCFG, SSPND, Clock Output, ADC, DAC, interrupt detector). Source: www.microchip.com/MCP2221 <http://www.microchip.com/wwwproducts/Devices.aspx?product=MCP2221> and www.microchipdirect.com <http://www.microchipdirect.com/ProductDetails.aspx?Category=MCP2221> Tutorial: MCP2221 by Arnauld Biganzoli <https://docs.google.com/document/d/1P3zzqCKdEXzCe--1Yyg8PClCZKsUri8pyNO7AV2daaw/edit?usp=sharing>
U$1 = dsPIC33EV32GM102:DSPIC33EV256GM106
UART1 UART2 = pinhead:PINHD-1X5: PIN HEADER

## Board
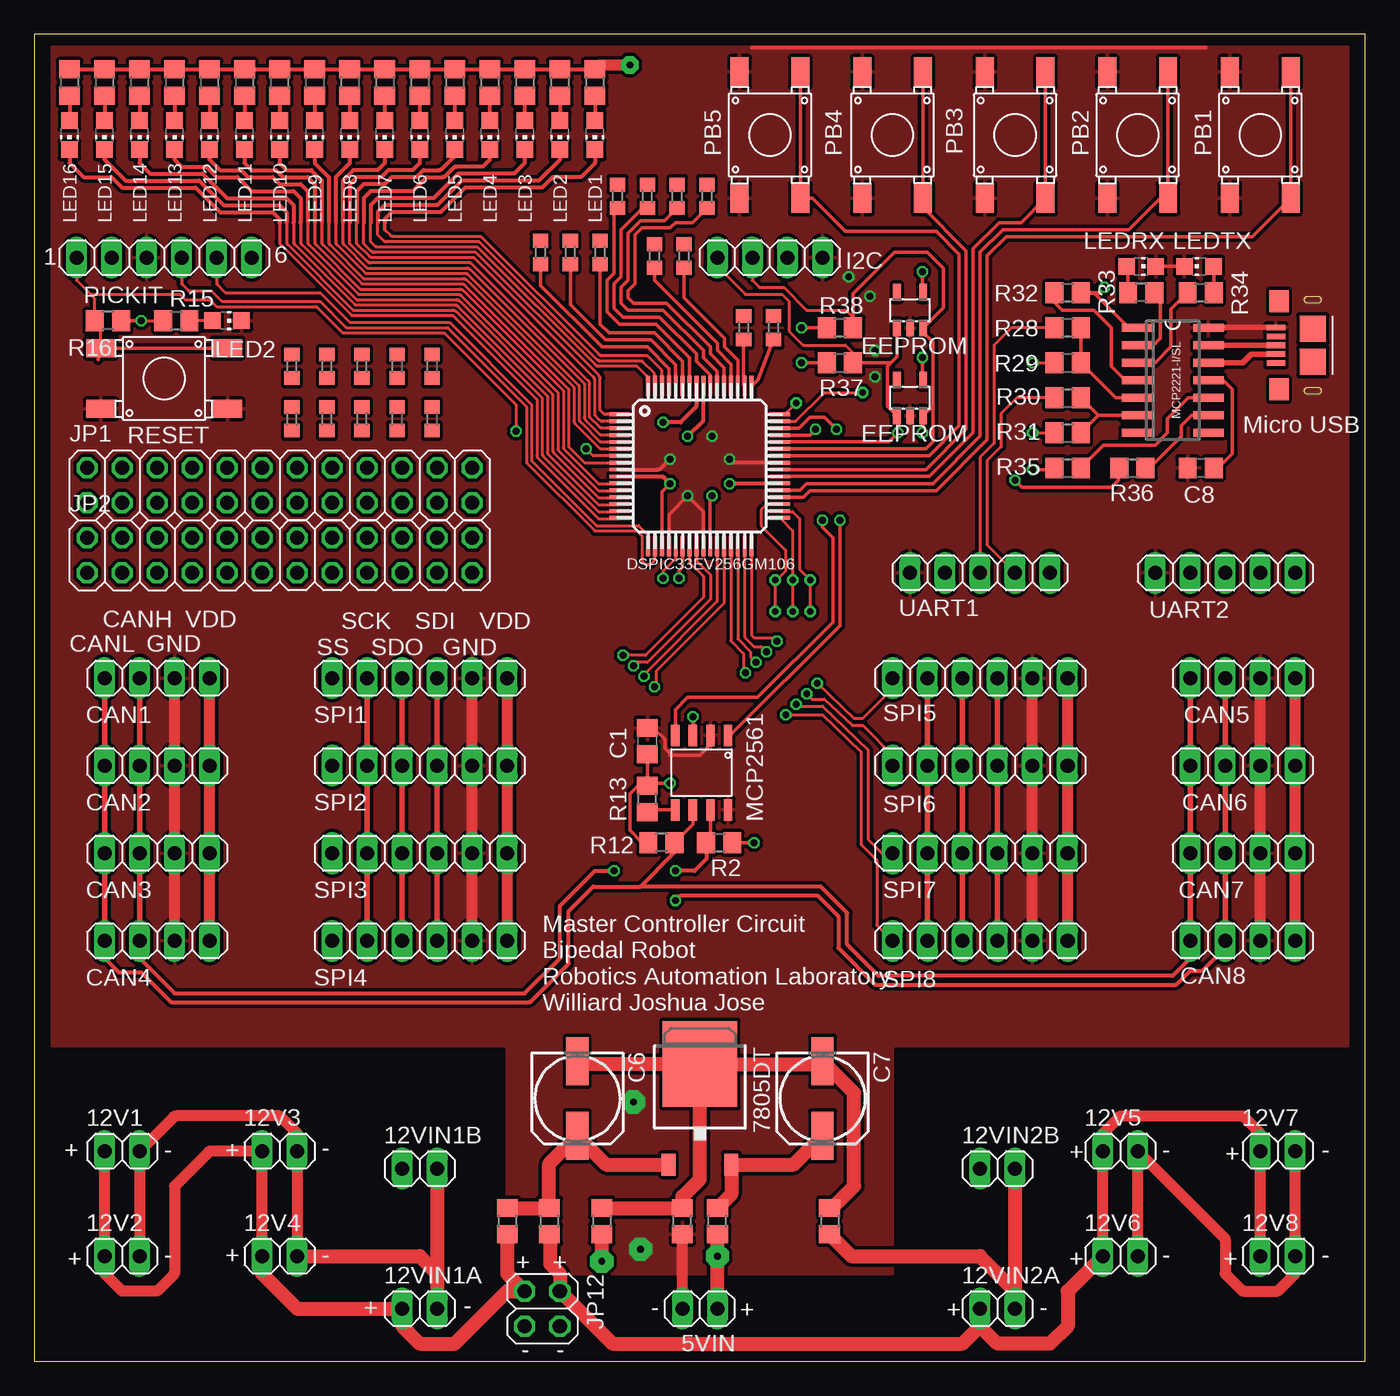
[diagram p5: board, top side]
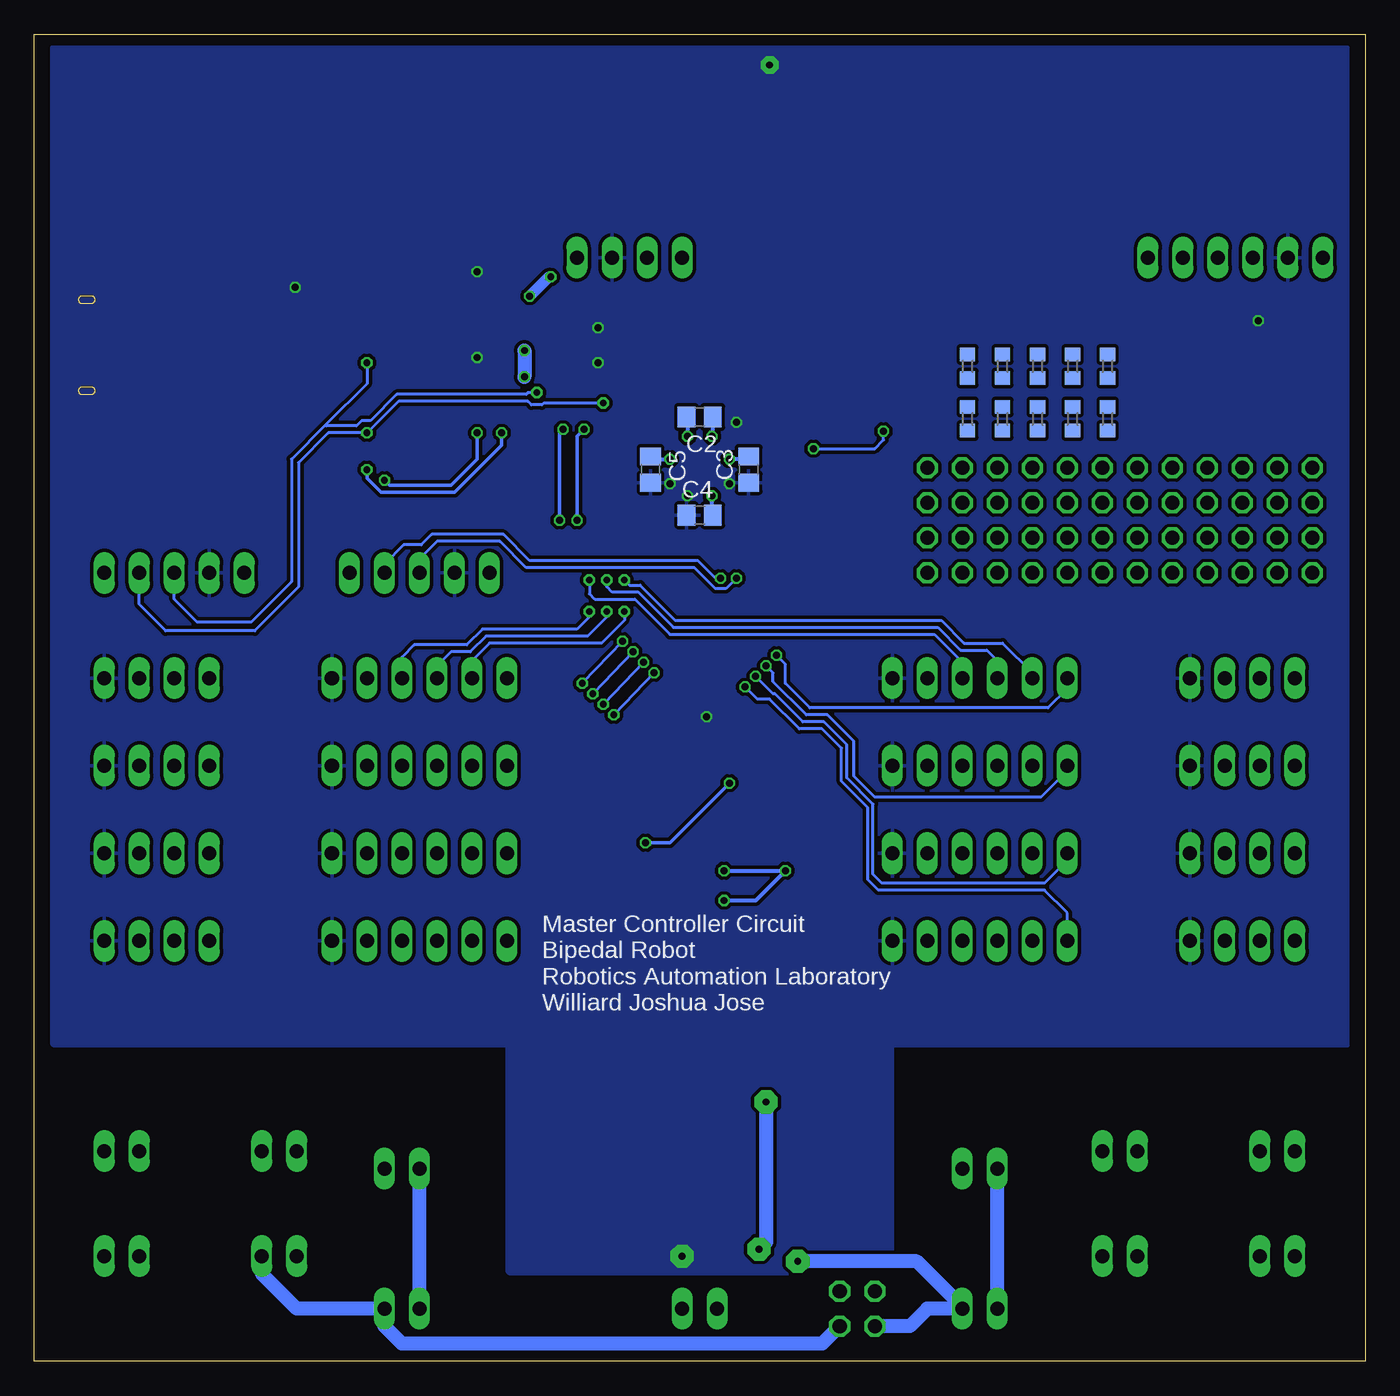
[diagram p6: board, bottom side, seen from below]

Size 96.5 x 96.19 mm. Coordinates in mm from the lower left corner, seen from the top.
Outline: 0,0 96.5,0 96.5,96.19 0,96.19 0,0
Copper layers (1*16): Top 0.035mm / dielectric 1.5mm / Bottom 0.035mm
Design rules "Elecrow_2-layer_eagle_rule": minimum track width 6mil, minimum drill 12mil, track to track 6mil, track to pad 6mil, pad to pad 6mil, via to via 6mil, smd to smd 0mil, copper to edge 10mil, drill to drill 10mil, minimum pad ring 10mil, minimum via ring 6mil, stop-mask expansion 2mil, vias tented up to drill 100mil, thermal gap 10mil

### Footprints (pad centres in the part's own frame; a part is rotated, then mirrored left to right if it is on the bottom)
1X02 = drill 1.016 long: 1 -1.27,0; 2 1.27,0
C0805 = smd 1.3 x 1.5: 1 -0.95,0; 2 0.95,0
153CLV-0605 = smd 3.5 x 1.6: + 2.7,0; - -2.7,0
1X04 = drill 1.016 long: 1 -3.81,0; 2 -1.27,0; 3 1.27,0; 4 3.81,0
TO252 = smd 1 x 1.6: 1 -2.28,-4.8; 2 2.28,-4.8 | smd 5.4 x 6.2: 3 0,2.5
SOT23-5L = smd 0.55 x 1.2: 1 -0.95,-1.3; 2 0,-1.3; 3 0.95,-1.3; 4 0.95,1.3; 5 -0.95,1.3
10118193-0001LF = smd 0.4 x 1.35: D+ 0,2.675; D- -0.65,2.675; GND 1.3,2.675; ID 0.65,2.675; VCC -1.3,2.675 | smd 1.6 x 1.4: SHIELD$1 -3.2,2.45; SHIELD$2 3.2,2.45 | smd 1.9 x 1.9: SHIELD$3 -1.2,0; SHIELD$4 1.2,0
2X12 = drill 1.016 octagon: 1 -13.97,-1.27; 2 -13.97,1.27; 3 -11.43,-1.27; 4 -11.43,1.27; 5 -8.89,-1.27; 6 -8.89,1.27; 7 -6.35,-1.27; 8 -6.35,1.27; 9 -3.81,-1.27; 10 -3.81,1.27; 11 -1.27,-1.27; 12 -1.27,1.27; 13 1.27,-1.27; 14 1.27,1.27; 15 3.81,-1.27; 16 3.81,1.27; 17 6.35,-1.27; 18 6.35,1.27; 19 8.89,-1.27; 20 8.89,1.27; 21 11.43,-1.27; 22 11.43,1.27; 23 13.97,-1.27; 24 13.97,1.27
2X02 = drill 1.016 octagon: 1 -1.27,-1.27; 2 -1.27,1.27; 3 1.27,-1.27; 4 1.27,1.27
CHIP-LED0805 = smd 1.2 x 1.2: A 0,-1.05; C 0,1.05
FSM4JSMA-SMD = smd 1.3 x 2.1: P$1 -2.196,4.584; P$2 -2.196,-4.6; P$3 2.204,4.584; P$4 2.204,-4.6
1X06 = drill 1.016 long: 1 -6.35,0; 2 -3.81,0; 3 -1.27,0; 4 1.27,0; 5 3.81,0; 6 6.35,0
R0805 = smd 1.3 x 1.5: 1 -0.95,0; 2 0.95,0
R0603 = smd 1 x 1.1: 1 -0.85,0; 2 0.85,0
SOIC-8 = smd 1.55 x 0.6: 1 -2.7,1.905; 2 -2.7,0.635; 3 -2.7,-0.635; 4 -2.7,-1.905; 5 2.7,-1.905; 6 2.7,-0.635; 7 2.7,0.635; 8 2.7,1.905
SOIC14 = smd 0.6 x 2.2: 1 -3.81,-2.6; 2 -2.54,-2.6; 3 -1.27,-2.6; 4 0,-2.6; 5 1.27,-2.6; 6 2.54,-2.6; 7 3.81,-2.6; 8 3.81,2.6; 9 2.54,2.6; 10 1.27,2.6; 11 0,2.6; 12 -1.27,2.6; 13 -2.54,2.6; 14 -3.81,2.6
TQFP64-10X10 = smd 1.5 x 0.28: 1 -5.8,3.75; 2 -5.8,3.25; 3 -5.8,2.75; 4 -5.8,2.25; 5 -5.8,1.75; 6 -5.8,1.25; 7 -5.8,0.75; 8 -5.8,0.25; 9 -5.8,-0.25; 10 -5.8,-0.75; 11 -5.8,-1.25; 12 -5.8,-1.75; 13 -5.8,-2.25; 14 -5.8,-2.75; 15 -5.8,-3.25; 16 -5.8,-3.75; 33 5.8,-3.75; 34 5.8,-3.25; 35 5.8,-2.75; 36 5.8,-2.25; 37 5.8,-1.75; 38 5.8,-1.25; 39 5.8,-0.75; 40 5.8,-0.25; 41 5.8,0.25; 42 5.8,0.75; 43 5.8,1.25; 44 5.8,1.75; 45 5.8,2.25; 46 5.8,2.75; 47 5.8,3.25; 48 5.8,3.75 | smd 0.28 x 1.5: 17 -3.75,-5.8; 18 -3.25,-5.8; 19 -2.75,-5.8; 20 -2.25,-5.8; 21 -1.75,-5.8; 22 -1.25,-5.8; 23 -0.75,-5.8; 24 -0.25,-5.8; 25 0.25,-5.8; 26 0.75,-5.8; 27 1.25,-5.8; 28 1.75,-5.8; 29 2.25,-5.8; 30 2.75,-5.8; 31 3.25,-5.8; 32 3.75,-5.8; 49 3.75,5.8; 50 3.25,5.8; 51 2.75,5.8; 52 2.25,5.8; 53 1.75,5.8; 54 1.25,5.8; 55 0.75,5.8; 56 0.25,5.8; 57 -0.25,5.8; 58 -0.75,5.8; 59 -1.25,5.8; 60 -1.75,5.8; 61 -2.25,5.8; 62 -2.75,5.8; 63 -3.25,5.8; 64 -3.75,5.8
1X05 = drill 1.016 long: 1 -5.08,0; 2 -2.54,0; 3 0,0; 4 2.54,0; 5 5.08,0

### Placement (x,y rotation side)
5VIN  48.26,3.81 180 top
12V1  6.35,15.24 0 top
12V2  6.35,7.62 0 top
12V3  17.78,15.24 0 top
12V4  17.78,7.62 0 top
12V5  78.74,15.24 0 top
12V6  78.74,7.62 0 top
12V7  90.17,15.24 0 top
12V8  90.17,7.62 0 top
12VIN1A  27.94,3.81 0 top
12VIN1B  27.94,13.97 0 top
12VIN2A  69.85,3.81 0 top
12VIN2B  69.85,13.97 0 top
C1  44.45,44.96 90 top
C2  48.26,68.45 180 bottom
C3  44.7,64.64 90 bottom
C4  48.26,61.34 0 bottom
C5  51.82,64.64 90 bottom
C6  39.37,19.05 270 top
C7  57.15,19.05 270 top
C8  84.58,64.77 180 top
CAN1  8.89,49.53 0 top
CAN2  8.89,43.18 0 top
CAN3  8.89,36.83 0 top
CAN4  8.89,30.48 0 top
CAN5  87.63,49.53 0 top
CAN6  87.63,43.18 0 top
CAN7  87.63,36.83 0 top
CAN8  87.63,30.48 0 top
I2C  53.34,80.01 180 top
IC1  48.26,19.05 0 top
IC2  63.5,76.2 0 top
IC3  63.5,69.85 0 top
J1  92.71,73.66 90 top
JP1  17.78,63.5 0 top
JP2  17.78,58.42 0 top
JP12  36.83,3.81 270 top
LED1  40.64,88.9 180 top
LED2  13.97,75.44 270 top
LED3  38.1,88.9 180 top
LED4  35.56,88.9 180 top
LED5  33.02,88.9 180 top
LED6  30.48,88.9 180 top
LED7  27.94,88.9 180 top
LED8  25.4,88.9 180 top
LED9  22.86,88.9 180 top
LED14  20.32,88.9 180 top
LED15  17.78,88.9 180 top
LED16  15.24,88.9 180 top
LED17  12.7,88.9 180 top
LED18  10.16,88.9 180 top
LED19  7.62,88.9 180 top
LED20  5.08,88.9 180 top
LED21  2.54,88.9 180 top
LEDRX  80.26,79.38 270 top
LEDTX  84.45,79.38 90 top
P1  88.9,88.9 0 top
P2  80.01,88.9 0 top
P3  71.12,88.9 0 top
P4  62.23,88.9 0 top
P5  53.34,88.9 0 top
PICKIT  9.4,80.01 0 top
R1  38.1,92.71 270 top
R2  49.66,37.59 0 top
R3  35.56,92.71 270 top
R4  33.02,92.71 270 top
R5  30.48,92.71 270 top
R6  27.94,92.71 270 top
R7  25.4,92.71 270 top
R8  22.86,92.71 270 top
R9  49.53,10.16 90 top
R10  46.99,10.16 90 top
R11  37.34,10.16 270 top
R12  45.47,37.59 180 top
R13  44.45,40.77 90 top
R14  40.64,92.71 270 top
R15  10.29,75.44 0 top
R16  5.33,75.44 180 top
R17  41.15,10.16 270 top
R18  20.32,92.71 270 top
R19  17.78,92.71 270 top
R20  15.24,92.71 270 top
R21  12.7,92.71 270 top
R22  10.16,92.71 270 top
R23  7.62,92.71 270 top
R24  5.08,92.71 270 top
R25  2.54,92.71 270 top
R26  57.66,10.16 270 top
R27  34.29,10.16 270 top
R28  74.93,74.93 0 top
R29  74.93,72.39 0 top
R30  74.93,69.85 0 top
R31  74.93,67.31 0 top
R32  74.93,77.47 0 top
R33  80.26,77.47 180 top
R34  84.58,77.47 0 top
R35  74.93,64.77 0 top
R36  79.63,64.77 0 top
R37  58.42,72.39 0 top
R38  58.42,74.93 0 top
R39  36.7,80.39 270 top
R40  38.86,80.39 270 top
R41  41.02,80.39 270 top
R42  42.29,84.45 270 top
R43  44.45,84.45 270 top
R44  46.61,84.45 270 top
R45  48.77,84.45 270 top
R46  44.96,80.14 270 top
R47  47.12,80.14 270 top
R48  51.44,74.93 270 top
R49  53.59,74.93 270 top
R50  18.67,68.33 90 top
R51  21.21,68.33 90 top
R52  23.75,68.33 90 top
R53  26.29,68.33 90 top
R54  28.83,68.33 90 top
R55  18.67,72.14 90 top
R56  21.21,72.14 90 top
R57  23.75,72.14 90 top
R58  26.29,72.14 90 top
R59  28.83,72.14 90 top
R60  18.67,72.14 270 bottom
R61  18.67,68.33 270 bottom
R62  21.21,68.33 270 bottom
R63  21.21,72.14 270 bottom
R64  23.75,68.33 270 bottom
R65  26.29,68.33 270 bottom
R66  23.75,72.14 270 bottom
R67  28.83,72.14 270 bottom
R68  28.83,68.33 270 bottom
R69  26.29,72.14 270 bottom
RESET  9.4,71.25 90 top
SPI1  27.94,49.53 0 top
SPI2  27.94,43.18 0 top
SPI3  27.94,36.83 0 top
SPI4  27.94,30.48 0 top
SPI5  68.58,49.53 0 top
SPI6  68.58,43.18 0 top
SPI7  68.58,36.83 0 top
SPI8  68.58,30.48 0 top
U1  48.39,42.67 270 top
U2  82.55,71.12 270 top
U$1  48.26,64.9 0 top
UART1  68.58,57.15 0 top
UART2  86.36,57.15 0 top

### Tracks (layer width: path | path; a pad name or v marks a point on that pad's centre or on a via)
12V+1
  Top 0.813: 12V1.1 12V2.1 5.08,6.35 6.28,5.15 arc45 6.46,5.08 8.89,5.08 10.09,6.28 arc45 10.16,6.46 10.16,12.7 12.63,15.17 arc-45 12.8,15.24 12V3.1 12V4.1 16.51,6.35
  Top 1.016: 16.51,6.35 19.05,3.81 12VIN1A.1 26.67,2.54 27.94,1.27 30.48,1.27 34.29,5.08 JP12.1 34.29,6.35 R27.2
  Bottom 1.016: 12VIN1A.1 12VIN1B.1
12V+2
  Top 0.813: 12V6.1 12V5.1 77.47,16.51 78.67,17.71 arc-45 78.84,17.78 87.63,17.78 88.83,16.58 arc-45 88.9,16.41 12V7.1 12V8.1
  Top 1.016: 68.58,2.54 67.31,1.27 41.91,1.27 JP12.2 38.1,6.35 37.4,7.05 37.4,9.21 R11.2 | 12V6.1 74.93,5.08 74.93,2.54 73.66,1.27 69.85,1.27 68.58,2.54 | 68.58,2.54 12VIN2A.1
  Bottom 1.016: 12VIN2A.1 12VIN2B.1
12V-1  (via drill 0.5 pad 1.68)
  Top 0.813: 12V2.2 12V1.2 10.09,17.71 arc-45 10.27,17.78 17.78,17.78 18.98,16.58 arc-45 19.05,16.41 12V3.2 12V4.2
  Top 1.016: v41.15,7.24 R17.2 | 12V4.2 27.94,7.62 29.21,6.35 12VIN1A.2 12VIN1B.2
  Bottom 1.016: JP12.3 33.02,2.54 31.75,3.81 12VIN1A.2 29.21,3.94 32.51,7.24 v41.15,7.24
12V-2
  Top 0.813: 12V6.2 12V5.2 86.29,8.96 arc-45 86.36,8.79 86.36,6.35 87.56,5.15 arc45 87.73,5.08 90.17,5.08 91.37,6.28 arc45 91.44,6.46 12V8.2 12V7.2
  Top 1.016: R26.2 59.25,7.62 68.58,7.62 71.12,5.08 12VIN2A.2 12VIN2B.2
  Bottom 1.016: 12V6.2 80.01,6.35 77.47,3.81 12VIN2A.2 71.12,2.54 69.85,1.27 39.37,1.27 JP12.4
!MCLR  (via drill 0.5 pad 0.25)
  Top 0.203: PICKIT.1 3.05,78.36 4.06,77.34 | 4.06,77.34 10.54,77.34 10.92,76.96 12.7,76.96 13.21,76.45 20.45,76.45 22.35,74.55 29.72,74.55 34.92,69.34 v34.92,67.44 | U$1.7 40.52,65.65 v40.01,66.17 | RESET.P$3 4.81,75.01 R16.2 4.38,77.02 4.06,77.34
  Top 0.254: 4.64,72.61 RESET.P$3 RESET.P$4
  Bottom 0.203: v40.01,66.17 35.56,66.17 34.92,66.8 v34.92,67.44
CANH  (via drill 0.5 pad 0.2, 0.5 pad 0.25)
  Top 0.254: U1.7 49.02,37.91 R2.1
  Top 0.305: CAN4.2 7.62,29.21 10.16,26.67 35.56,26.67 38.1,29.21 38.1,33.02 40.64,35.56 v42.04,35.56 | R2.1 48.77,37.53 48.77,36.45 47.88,35.56 v46.48,35.56 | v46.48,33.4 46.86,33.78 56.77,33.78 58.29,32.26 58.29,29.97 60.96,27.3 82.8,27.3 83.82,28.32 84.71,28.32 86.36,29.97 CAN8.2
  Top 0.406: CAN4.2 CAN3.2 CAN2.2 CAN1.2 | CAN8.2 CAN7.2 CAN6.2 CAN5.2
  Bottom 0.305: v46.48,35.56 v42.04,35.56 44.2,33.4 v46.48,33.4
CANL
  Top 0.254: U1.6 47.75,38.93 R12.1
  Top 0.305: CAN4.1 5.08,29.21 6.1,28.19 7.75,28.19 9.91,26.04 35.94,26.04 38.73,28.83 38.73,32.64 40.51,34.42 43.94,34.42 | 43.94,34.42 46.35,36.83 46.35,37.53 R12.1 | CAN8.1 83.82,29.21 82.55,27.94 61.21,27.94 58.93,30.23 58.93,32.51 57.02,34.42 43.94,34.42
  Top 0.406: CAN4.1 CAN3.1 CAN2.1 CAN1.1 | CAN8.1 CAN7.1 CAN6.1 CAN5.1
CANRX  (via drill 0.5 pad 0.25)
  Top 0.254: U1.4 46.48,47.24 47.37,48.13 52.45,48.13 57.91,53.59 57.91,59.69 57.15,60.45 v57.15,60.96 | U$1.45 56.23,67.15 v56.64,67.56
  Bottom 0.254: v57.15,60.96 57.15,67.06 v56.64,67.56
CANTX  (via drill 0.5 pad 0.25)
  Top 0.254: U1.1 50.45,45.37 58.42,53.34 v58.42,60.96 | U$1.46 55.45,67.65 56.26,68.45 57.28,68.45 v58.17,67.56
  Bottom 0.254: v58.42,60.96 58.42,67.31 v58.17,67.56
D+
  Top 0.406: J1.D+ U2.13
D-
  Top 0.406: J1.D- 88.25,73.01 87.63,72.39 U2.12
GP0
  Top 0.254: U2.2 81.15,73.66 81.66,74.17 81.66,77.02 R33.1
GP1
  Top 0.254: U2.3 81.28,72.39 82.42,73.53 82.42,76.26 R34.1
LED1
  Top 0.203: U$1.62 45.51,71.78 arc45 45.47,71.88 44.45,72.9 41.15,72.9 arc-45 40.93,72.99 32.38,81.53 26.04,81.53 arc-45 25.82,81.63 25.4,82.04
  Top 0.254: 25.4,82.04 25.4,82.55
  Top 0.305: LED1.C 40.64,86.87 39.62,85.85 37.59,85.85 36.83,85.09 31.24,85.09 29.46,83.31 25.91,83.31 25.4,82.8 25.4,82.55
LED2
  Top 0.203: U$1.63 45.01,71.38 arc45 44.96,71.5 44.96,71.63 44.07,72.52 41.03,72.52 arc-45 40.8,72.61 32.26,81.15 25.53,81.15 arc-45 25.31,81.25 24.89,81.66 24.89,82.55
  Top 0.305: LED3.C 38.1,87.12 36.58,85.6 30.99,85.6 29.21,83.82 25.4,83.82 24.89,83.31 24.89,82.55
LED3
  Top 0.203: U$1.64 44.51,71.18 arc45 44.42,71.41 43.69,72.14 40.9,72.14 arc-45 40.67,72.23 32.13,80.77 24.9,80.77 arc-45 24.67,80.86 24.38,81.15 24.38,82.55
  Top 0.305: LED4.C 35.56,86.87 34.8,86.11 30.73,86.11 28.96,84.33 24.89,84.33 24.38,83.82 24.38,82.55
LED4
  Top 0.203: U$1.1 41.47,68.65 arc-45 41.24,68.74 41.02,68.96 41.02,71.24 arc45 40.93,71.47 32,80.39 24.64,80.39 arc-45 24.42,80.48 23.88,81.03 23.88,82.55
  Top 0.305: LED5.C 33.02,87.12 32.51,86.61 30.61,86.61 arc45 30.39,86.52 29.81,85.94 arc-45 29.59,85.85 28.45,85.85 27.43,84.84 24.38,84.84 23.88,84.33 23.88,82.55
LED5
  Top 0.203: U$1.2 41.2,68.15 arc-45 40.98,68.24 40.64,68.58 40.64,71.11 arc45 40.55,71.34 31.88,80.01 24.52,80.01 arc-45 24.29,80.1 23.37,81.03 23.37,82.55
  Top 0.305: 23.37,82.55 23.37,84.84 23.88,85.34 25.4,85.34 25.91,85.85 27.69,85.85 28.19,86.36 29.33,86.36 arc45 29.56,86.45 30.48,87.38 LED6.C
LED6
  Top 0.203: U$1.3 41.2,67.65 arc-45 40.97,67.74 40.26,68.45 40.26,70.86 arc45 40.17,71.09 31.62,79.63 24.39,79.63 arc-45 24.16,79.72 22.86,81.03 22.86,82.55
  Top 0.305: LED7.C 27.94,86.87 27.43,86.36 25.65,86.36 25.15,85.85 23.37,85.85 22.86,85.34 22.86,82.55
LED7
  Top 0.203: 22.35,82.55 22.35,81.16 arc45 22.45,80.93 24.13,79.25 31.36,79.25 arc-45 31.59,79.16 39.88,70.87 39.88,68.46 arc45 39.97,68.23 41.02,67.18 42.37,67.18 arc-45 U$1.4
  Top 0.305: LED8.C 25.4,86.87 24.89,86.36 23.11,86.36 22.35,85.6 22.35,82.55
LED8
  Top 0.203: 21.84,82.55 21.84,81.16 arc45 21.94,80.93 24,78.87 31.24,78.87 arc-45 31.46,78.77 39.5,70.74 39.5,68.33 arc45 39.59,68.11 41.02,66.67 42.39,66.67 arc-45 U$1.5
  Top 0.305: LED9.C 22.86,86.87 21.84,85.85 21.84,82.55
LED9
  Top 0.203: 21.34,82.55 21.34,81.16 arc45 21.43,80.93 23.88,78.49 31.11,78.49 arc-45 31.34,78.39 39.12,70.61 39.12,68.2 arc45 39.21,67.98 41.02,66.17 42.41,66.17 arc-45 U$1.6
  Top 0.305: LED14.C 20.32,86.87 21.34,85.85 21.34,82.55
LED10
  Top 0.203: 20.83,82.55 20.83,81.16 arc45 20.92,80.93 23.75,78.11 30.98,78.11 arc-45 31.21,78.01 38.73,70.48 38.73,66.29 39.88,65.15 U$1.8 arc-45 U$1.8
  Top 0.305: LED15.C 17.78,86.87 18.29,86.36 20.07,86.36 20.83,85.6 20.83,82.55
LED11
  Top 0.203: 20.32,82.55 20.32,81.16 arc45 20.41,80.93 23.62,77.72 30.86,77.72 arc-45 31.08,77.63 38.35,70.36 38.35,66.3 arc45 38.45,66.07 40.89,63.63 42.41,63.63 arc45 U$1.11
  Top 0.305: LED16.C 15.24,86.87 15.75,86.36 17.53,86.36 18.03,85.85 19.81,85.85 20.32,85.34 20.32,82.55
LED12
  Top 0.203: 19.81,82.55 19.81,81.16 arc45 19.91,80.93 23.5,77.34 30.73,77.34 arc-45 30.95,77.25 37.97,70.23 37.97,66.17 arc45 38.07,65.95 40.89,63.12 42.39,63.12 arc45 U$1.12
  Top 0.305: LED17.C 12.7,87.12 13.46,86.36 14.99,86.36 15.49,85.85 17.27,85.85 17.78,85.34 19.3,85.34 19.81,84.84 19.81,82.55
LED13
  Top 0.203: 19.3,82.55 19.3,81.16 arc45 19.4,80.93 23.37,76.96 30.6,76.96 arc-45 30.83,76.87 37.59,70.1 37.59,66.05 arc45 37.69,65.82 40.89,62.61 42.37,62.61 arc45 U$1.13
  Top 0.305: LED18.C 10.16,87.12 10.67,86.61 12.45,86.61 13.21,85.85 14.73,85.85 15.75,84.84 18.8,84.84 19.3,84.33 19.3,82.55
LED14
  Top 0.203: 18.8,82.55 18.8,81.16 arc45 18.89,80.93 23.24,76.58 30.48,76.58 arc-45 30.7,76.49 37.21,69.98 37.21,65.92 arc45 37.3,65.69 40.89,62.1 42.35,62.1 arc45 U$1.14
  Top 0.305: LED19.C 7.62,86.87 8.38,86.11 12.19,86.11 13.97,84.33 18.29,84.33 18.8,83.82 18.8,82.55
LED15
  Top 0.203: 18.29,82.55 18.29,81.16 arc45 18.38,80.93 23.11,76.2 30.35,76.2 arc-45 30.57,76.11 36.83,69.85 36.83,65.79 arc45 36.92,65.57 40.89,61.59 42.33,61.59 arc45 U$1.15
  Top 0.305: LED20.C 5.08,87.12 6.6,85.6 11.94,85.6 13.72,83.82 17.78,83.82 18.29,83.31 18.29,82.55
LED16
  Top 0.203: 17.78,82.55 17.78,81.16 arc45 17.87,80.93 22.99,75.82 30.22,75.82 arc-45 30.45,75.73 36.45,69.72 36.45,65.66 arc45 36.54,65.44 40.89,61.09 42.31,61.09 arc45 U$1.16
  Top 0.305: LED21.C 2.54,86.87 3.56,85.85 5.59,85.85 6.35,85.09 11.68,85.09 13.46,83.31 17.27,83.31 17.78,82.8 17.78,82.55
N$3  (via drill 0.5 pad 0.2)
  Top 0.254: C1.1 R13.2 | R13.2 44.39,41.66 43.69,41.66 43.18,41.15 43.18,38.48 44.07,37.59 R12.2 | R2.2 v52.2,37.59 | R13.2 44.64,41.91 v46.1,41.91
  Bottom 0.254: v52.2,37.59 50.42,37.59 v46.1,41.91
N$4
  Top 0.305: R14.2 LED1.A
N$6
  Top 0.203: LED2.A R15.2
N$15
  Top 0.254: U2.5 78.42,69.85 R29.2 R28.2
N$16
  Top 0.254: 77.15,68.58 R31.2 | R30.2 77.15,68.58 | 77.15,68.58 U2.6
N$17
  Top 1.016: C7.+ 55.05,14.25 IC1.2 50.54,12.12 R9.2
N$18
  Top 1.016: IC1.3 48.26,13.21 46.99,11.94 R10.2 R17.1 | IC1.3 56.95,21.55 C7.- 59.44,19.46 59.44,12.7 57.85,11.11 R26.1 | IC1.3 39.57,21.55 C6.-
N$19
  Top 0.254: U2.10 83.69,69.85 82.17,68.33 82.17,67.31 81.28,66.42 77.53,66.42 R35.2
N$20
  Top 0.254: U2.9 83.95,68.58 83.19,67.82 83.19,67.06 81.15,65.02 80.83,65.02 R36.2
N$21
  Top 1.016: IC1.1 41.47,14.25 C6.+ 37.34,14.32 R11.1 R27.1
N$30
  Top 0.254: U2.4 79.12,71.12 78.11,72.14 78.11,74.93 76.83,76.2 74.55,76.2 73.91,76.83 73.91,77.4 R32.1
N$31
  Top 0.254: R33.2 79.31,79.28 LEDRX.A
N$32
  Top 0.254: R34.2 85.53,79.35 LEDTX.A
N$68
  Top 0.305: R1.2 LED3.A
N$69
  Top 0.305: R3.2 LED4.A
N$70
  Top 0.305: R4.2 LED5.A
N$71
  Top 0.305: R5.2 LED6.A
N$72
  Top 0.305: R6.2 LED7.A
N$73
  Top 0.305: R7.2 LED8.A
N$74
  Top 0.305: R8.2 LED9.A
N$79
  Top 0.305: R18.2 LED14.A
N$80
  Top 0.305: R19.2 LED15.A
N$81
  Top 0.305: R20.2 LED16.A
N$82
  Top 0.305: R21.2 LED17.A
N$83
  Top 0.305: R22.2 LED18.A
N$84
  Top 0.305: R23.2 LED19.A
N$85
  Top 0.305: R24.2 LED20.A
N$86
  Top 0.305: R25.2 LED21.A
PB1
  Top 0.254: P1.P$3 P1.P$4 88.34,81.53 70.48,81.53 69.09,80.14 69.09,66.8 65.41,63.12 56.26,63.12 55.79,62.65 U$1.36
PB2
  Top 0.254: P2.P$3 P2.P$4 82.11,84.2 81.53,84.2 79.38,82.04 70.23,82.04 68.58,80.39 68.58,67.06 65.15,63.63 56.01,63.63 55.53,63.15 U$1.37
PB3
  Top 0.254: P3.P$3 P3.P$4 71.57,82.55 69.98,82.55 68.07,80.64 68.07,67.31 64.91,64.15 U$1.39
PB4
  Top 0.254: P4.P$3 P4.P$4 64.39,84.25 64.39,83.69 67.56,80.52 67.56,67.56 64.65,64.65 U$1.40
PB5
  Top 0.254: P5.P$3 P5.P$4 56.42,84.3 58.8,81.92 65.41,81.92 67.06,80.26 67.06,67.82 64.9,65.66 54.07,65.66 U$1.42
PGC
  Top 0.203: PICKIT.5 13.21,78.11 13.84,77.47 20.7,77.47 22.86,75.31 30.1,75.31 36.07,69.34 36.07,65.28 40.77,60.58 43.81,60.58 44.51,59.88 U$1.17
PGD
  Top 0.203: PICKIT.4 10.67,78.11 11.18,77.6 12.83,77.6 13.59,76.83 20.7,76.83 22.61,74.93 29.97,74.93 35.69,69.22 35.69,65.15 40.64,60.2 43.69,60.2 44.07,59.82 44.07,58.04 44.32,57.78 44.7,57.78 45.01,58.09 U$1.18
SCK1  (via drill 0.5 pad 0.25)
  Top 0.203: U$1.35 54.02,62.1 53.09,62.1 52.7,61.72 52.7,60.58 54.48,58.8 54.48,57.28 53.85,56.64 v53.72,56.64 v53.72,54.36
  Top 0.406: SPI1.2 SPI2.2 SPI3.2 SPI4.2 | SPI8.2 SPI7.2 SPI6.2 SPI5.2
  Bottom 0.203: v53.72,56.64 53.34,56.26 52.58,56.26 50.04,53.72 30.73,53.72 29.08,52.07 26.29,52.07 24.13,49.91 SPI1.2 | v53.72,54.36 53.72,53.72 55.37,52.07 63.5,52.07 64.77,50.8 SPI5.2
SCL  (via drill 0.5 pad 0.25)
  Top 0.203: I2C.4 49.53,79.38 51.56,77.34 54.23,77.34 54.74,76.83 54.74,74.68 55.75,73.66 58.8,73.66 59.31,73.15 59.31,72.45 R37.2
  Top 0.254: IC3.1 61.85,69.25 61.85,72.14 62.1,72.39 | IC2.1 62.55,72.84 62.1,72.39 | IC3.1 62.33,68.55 | U$1.44 54.09,66.67 61.98,66.67 v62.61,67.31 62.61,68.49 IC3.1 | R37.2 62.1,72.39 | v72.39,64.64 73.85,64.64 R35.1
  Bottom 0.254: v62.61,67.31 62.61,66.42 66.04,62.99 71.37,62.99 72.39,64.01 v72.39,64.64
SDA  (via drill 0.5 pad 0.25)
  Top 0.203: 59.37,75.69 58.86,76.2 56.01,76.2 54.36,77.85 52.58,77.85 52.07,78.36 I2C.3
  Top 0.254: 65.15,69.25 IC3.3 64.45,67.37 v64.39,67.31 | 65.15,69.25 65.15,73.91 64.45,74.61 IC2.3 65.91,76.36 65.91,79.25 64.77,80.39 62.36,80.39 59.37,77.4 59.37,75.69 R38.2 | U$1.43 54.08,66.17 64.64,66.17 65.15,66.67 65.15,69.25 | R36.1 78.61,64.7 78.61,63.88 78.11,63.37 71.63,63.37 v71.12,63.88
  Bottom 0.254: v64.39,67.31 64.39,65.41 66.29,63.5 70.74,63.5 v71.12,63.88
SDI1  (via drill 0.5 pad 0.25)
  Top 0.203: U$1.34 54.11,61.59 54.99,61.59 55.5,61.09 55.5,57.4 v56.26,56.64 56.39,56.64 56.26,56.52 v56.26,54.36
  Top 0.406: SPI1.4 SPI2.4 SPI3.4 SPI4.4 | SPI5.4 SPI6.4 SPI7.4 SPI8.4
  Bottom 0.203: v56.26,56.64 56.26,55.63 55.88,55.24 52.96,55.24 50.42,52.7 31.24,52.7 29.21,50.67 SPI1.4 | v56.26,54.36 56.26,53.98 57.15,53.09 64.01,53.09 65.15,51.94 68.96,51.94 69.85,51.05 SPI5.4
SDO1  (via drill 0.5 pad 0.25)
  Top 0.203: U$1.33 54.99,60.22 v54.99,56.64 v54.99,54.36
  Top 0.406: SPI4.3 SPI3.3 SPI2.3 SPI1.3 | SPI8.3 SPI7.3 SPI6.3 SPI5.3
  Bottom 0.203: v54.99,56.64 54.99,56.13 54.61,55.75 52.7,55.75 50.16,53.21 30.99,53.21 29.34,51.56 27.43,51.56 26.67,50.8 SPI1.3 | SPI5.3 67.31,50.42 66.29,51.44 64.9,51.44 63.75,52.58 56.39,52.58 54.99,53.98 v54.99,54.36
SPLIT
  Top 0.254: R13.1 44.6,39.97 U1.5
SS1  (via drill 0.5 pad 0.25)
  Top 0.203: U$1.23 47.51,57.9 48.51,56.9 48.51,55.37 44.32,51.18 v42.67,51.18
  Bottom 0.203: SPI1.1 21.59,48.77 22.99,47.37 40.26,47.37 42.04,49.15 42.04,50.55 v42.67,51.18
SS2  (via drill 0.5 pad 0.25)
  Top 0.203: U$1.24 48.01,58.03 49.02,57.02 49.02,55.24 44.45,50.67 43.69,50.67 v43.43,50.42
  Bottom 0.203: SPI2.1 21.59,42.8 23.5,40.89 35.56,40.89 37.08,42.42 37.08,44.96 38.99,46.86 40.51,46.86 42.93,49.28 42.93,49.91 v43.43,50.42
SS3  (via drill 0.5 pad 0.25)
  Top 0.203: U$1.27 49.51,55.1 44.2,49.78 v44.2,49.66
  Bottom 0.203: SPI3.1 21.59,36.32 23.24,34.67 35.05,34.67 35.69,35.31 35.69,40.39 37.59,42.29 37.59,44.7 39.24,46.35 40.77,46.35 42.8,48.39 42.93,48.39 v44.2,49.66
SS4  (via drill 0.5 pad 0.25)
  Top 0.203: U$1.28 50.01,54.96 45.09,50.04 45.09,49.02 v44.96,48.9
  Bottom 0.203: SPI4.1 21.59,32.51 23.24,34.16 35.31,34.16 36.07,34.92 36.07,40.13 37.97,42.04 37.97,44.45 39.37,45.85 41.02,45.85 43.18,48.01 44.07,48.01 v44.96,48.9
SS5  (via drill 0.5 pad 0.25)
  Top 0.203: U$1.32 52.01,52.64 52.2,52.45 53.59,52.45 v53.85,52.2 | v56.77,49.15 59.44,46.61 60.07,46.61 62.23,48.77 SPI5.1
  Bottom 0.203: v53.85,52.2 v56.77,49.15
SS6  (via drill 0.5 pad 0.25)
  Top 0.203: U$1.31 51.51,52.5 52.2,51.82 52.7,51.82 v53.09,51.44 | v56.01,48.39 56.39,48.01 57.28,48.01 59.31,46.1 60.07,46.1 62.23,43.94 SPI6.1
  Bottom 0.203: v53.09,51.44 v56.01,48.39
SS7  (via drill 0.5 pad 0.25)
  Top 0.203: U$1.30 51.01,52.37 51.94,51.44 51.94,51.05 v52.32,50.67 | v55.24,47.62 55.37,47.5 57.15,47.5 60.45,44.32 60.45,37.85 61.47,36.83 SPI7.1
  Bottom 0.203: v52.32,50.67 v55.24,47.62
SS8  (via drill 0.5 pad 0.25)
  Top 0.203: U$1.29 50.51,52.23 51.44,51.31 51.44,50.04 v51.56,49.91 | v54.48,46.86 57.15,46.86 59.94,44.2 59.94,37.47 61.09,36.32 61.09,31.62 SPI8.1
  Bottom 0.203: v51.56,49.91 v54.48,46.86
UARX1  (via drill 0.5 pad 0.25)
  Top 0.203: R28.1 70.87,74.93 69.6,73.66 69.6,66.55 68.58,65.53 UART1.3 | U$1.21 46.51,58.19 45.59,57.28 v45.59,56.77
  Bottom 0.203: v45.59,56.77 46.35,56.01 47.12,56.01 48.64,57.53 60.83,57.53 62.74,59.44 67.31,59.44 68.58,58.17 UART1.3
UARX2  (via drill 0.5 pad 0.25)
  Top 0.203: v60.07,70.23 57.28,70.23 55.19,68.15 U$1.47 | v72.39,72.39 R29.1
  Bottom 0.203: v72.39,72.39 72.39,70.87 75.37,67.88 | 75.37,67.88 77.85,65.41 77.85,56.52 80.77,53.59 84.71,53.59 86.36,55.24 UART2.3 | v60.07,70.23 60.71,70.23 60.83,70.1 70.23,70.1 72.14,68.2 72.77,68.2 73.15,67.82 75.31,67.82 75.37,67.88
UATX1  (via drill 0.5 pad 0.25)
  Top 0.203: R30.1 71.25,69.85 70.1,68.71 70.1,66.29 69.09,65.28 69.09,59.18 UART1.4 | U$1.22 47.01,57.55 46.74,57.28 v46.74,56.77
  Bottom 0.203: v46.74,56.77 47.12,56.77 48.39,58.04 60.58,58.04 62.48,59.94 67.69,59.94 68.45,59.18 69.72,59.18 71.12,57.78 UART1.4
UATX2  (via drill 0.5 pad 0.25)
  Top 0.203: U$1.48 54.42,68.65 v55.24,69.47 | v72.39,67.31 R31.1
  Bottom 0.203: v55.24,69.47 59.56,69.47 59.69,69.34 60.45,69.34 60.71,69.6 70.1,69.6 v72.39,67.31 75.18,67.31 77.34,65.15 77.34,56.13 80.52,52.96 87,52.96 88.9,54.86 UART2.4
VCAP  (via drill 0.5 pad 0.2)
  Top 0.305: v47.37,67.06 48.51,68.2 48.51,70.69 arc45 U$1.56
  Bottom 0.305: C2.1 47.31,67.2 arc45 v47.37,67.06
VDD  (via drill 0.5 pad 0.2, 0.5 pad 0.25, 0.5 pad 1.27, 0.5 pad 1.68)
  Top 0.203: v7.75,75.44 R15.1
  Top 0.254: IC3.4 64.39,71.21 v64.39,72.77 | IC2.4 64.39,77.56 v64.39,78.99 | U2.1 79.38,74.93 76.83,77.47 R32.2 | v55.63,74.93 R38.1 | v55.63,72.39 R37.1 | R16.1 v7.75,75.44 | U$1.26 49.01,62.6 v49.15,62.74 | U$1.19 45.51,63.04 v46.1,63.63
  Top 0.305: R25.1 R24.1 R23.1 R22.1 R21.1 R20.1 R19.1 R18.1 R8.1 R7.1 R6.1 R5.1 R4.1 R3.1 R1.1 R14.1 | U$1.38 arc-45 54.01,63.63 v50.42,63.63 | U$1.10 45.45,64.15 arc-45 45.67,64.05 v46.1,63.63 | U$1.57 48.01,69.35 arc-45 47.92,69.13 46.86,68.07 v45.59,68.07 | v47.75,46.74 U1.3 | R32.2 77.22,77.47 v77.6,77.85
  Top 0.813: SPI1.6 SPI2.6 SPI3.6 SPI4.6 | CAN4.4 CAN3.4 CAN2.4 CAN1.4 | SPI8.6 SPI7.6 SPI6.6 SPI5.6 | CAN8.4 CAN7.4 CAN6.4 CAN5.4 | R14.1 40.89,93.91 arc-45 41.06,93.98 v43.18,93.98
  Top 1.016: 5VIN.1 v49.53,7.62 R9.1
  pour Bottom (isolate 0.254): 1.27,95.25 1.27,22.86 34.29,22.86 34.29,6.35 61.98,6.35 arc90 62.23,6.6 62.23,22.86 95,22.86 arc90 95.25,23.11 95.25,95.25
VSS  (via drill 0.5 pad 0.2, 0.5 pad 0.25, 0.5 pad 1.68)
  Top 0.254: U1.2 49.15,45.24 49.15,44.83 48.26,43.94 46.1,43.94 46.1,44.07 45.72,44.45 45.72,45.09 44.9,45.91 C1.2 | LEDTX.C LEDRX.C | U$1.25 48.51,61.6 v47.37,62.74 46.01,61.38 U$1.20
  Top 0.305: 52.07,95.25 84.94,95.25 | U$1.41 arc45 U$1.41 50.8,65.15 arc-45 50.58,65.24 v50.42,65.41 | U$1.9 45.21,64.65 arc45 45.44,64.74 v46.1,65.41
  Top 0.406: J1.GND 86.39,74.96 86.36,74.93 U2.14
  Top 0.813: SPI4.5 SPI3.5 SPI2.5 SPI1.5 | CAN4.3 CAN3.3 CAN2.3 CAN1.3 | SPI8.5 SPI7.5 SPI6.5 SPI5.5 | CAN8.3 CAN7.3 CAN6.3 CAN5.3 | 5VIN.2 R10.1
  Bottom 0.254: C4.2 47.31,61.91
  Bottom 0.305: C5.2 51.72,65.5 arc-45 51.5,65.41 v50.42,65.41 | C2.2 arc45 49.15,68.31 v49.15,67.06 | C4.2 arc45 47.37,61.49 v47.37,62.74 | C3.2 44.8,65.5 arc45 45.02,65.41 v46.1,65.41
  Bottom 0.813: v59.05,78.61 59.18,78.61 v60.58,77.22
  Bottom 1.016: v43.43,18.8 43.43,8.64 v43.94,8.13 | v60.96,73.28 v60.96,71.37
  pour Top (isolate 0.254): 1.27,95.25 1.27,22.86 34.29,22.86 34.29,6.35 62.23,6.35 62.23,22.86 95.25,22.86 95.25,95.25
VUSB
  Top 0.254: C8.1 85.85,64.77 86.87,65.79 86.87,70.48 86.23,71.12 U2.11
X1
  Top 0.254: U$1.61 46.01,71.97 44.45,73.53 41.15,73.53 36.7,77.98 R39.2
X2
  Top 0.254: R40.2 38.86,76.58 41.4,74.04 44.7,74.04 46.48,72.26 46.48,70.72 U$1.60
X3
  Top 0.254: U$1.59 47.01,72.37 46.99,72.39 46.99,72.52 44.96,74.55 41.66,74.55 41.02,75.18 R41.2
X4
  Top 0.254: U$1.58 47.51,72.76 45.09,75.18 42.42,75.18 41.53,76.07 41.53,78.36 42.04,78.87 42.04,83.35 R42.2
X5
  Top 0.254: U$1.55 49.01,71.51 48.01,72.52 48.01,73.03 45.34,75.69 42.67,75.69 42.04,76.33 42.04,78.11 42.55,78.61 42.55,82.04 44.11,83.61 R43.2
X6
  Top 0.254: U$1.54 49.51,71.78 48.51,72.77 48.51,73.28 45.59,76.2 43.05,76.2 42.55,76.71 42.55,77.85 43.05,78.36 43.05,81.79 43.94,82.68 45.68,82.68 R44.2
X7
  Top 0.254: U$1.53 50.01,72.04 49.02,73.03 49.02,73.53 45.85,76.71 43.43,76.71 43.05,77.09 43.05,77.6 43.56,78.11 43.56,81.66 44.07,82.17 46.1,82.17 46.48,82.55 47.71,82.55 R45.2
X8
  Top 0.254: U$1.52 50.51,72.3 49.53,73.28 49.53,73.79 44.96,78.36 R46.2
X9
  Top 0.254: U$1.51 51.01,72.56 50.04,73.53 50.04,74.17 47.12,77.09 R47.2
X10
  Top 0.254: U$1.50 51.44,70.77 R48.2
X11
  Top 0.254: U$1.49 52.47,71.16 R49.2

### Text on the board
tNames: PB3 | PB5 | PB4 | PB2 | PB1 | LED16 | LED15 | LED14 | LED13 | LED12 | LED11 | LED10 | LED9 | LED8 | LED7 | LED6 | LED5 | LED4 | LED3 | LED2 | LED1 | 1 | 6 | EEPROM | EEPROM | Micro USB | CANH | VDD | SCK | SDI | VDD | CANL | GND | SS | SDO | GND | MCP2561 | Master Controller Circuit / Bipedal Robot / Robotics Automation Laboratory / Williard Joshua Jose | + | - | + | - | + | - | - | + | + | - | + | - | + | + | + | - | + | - | + | - | - | + | + | - | - | -
bNames: Master Controller Circuit / Bipedal Robot / Robotics Automation Laboratory / Williard Joshua Jose